# EAGLE schematic interfacez_r2_2 (EAGLE 6.4)
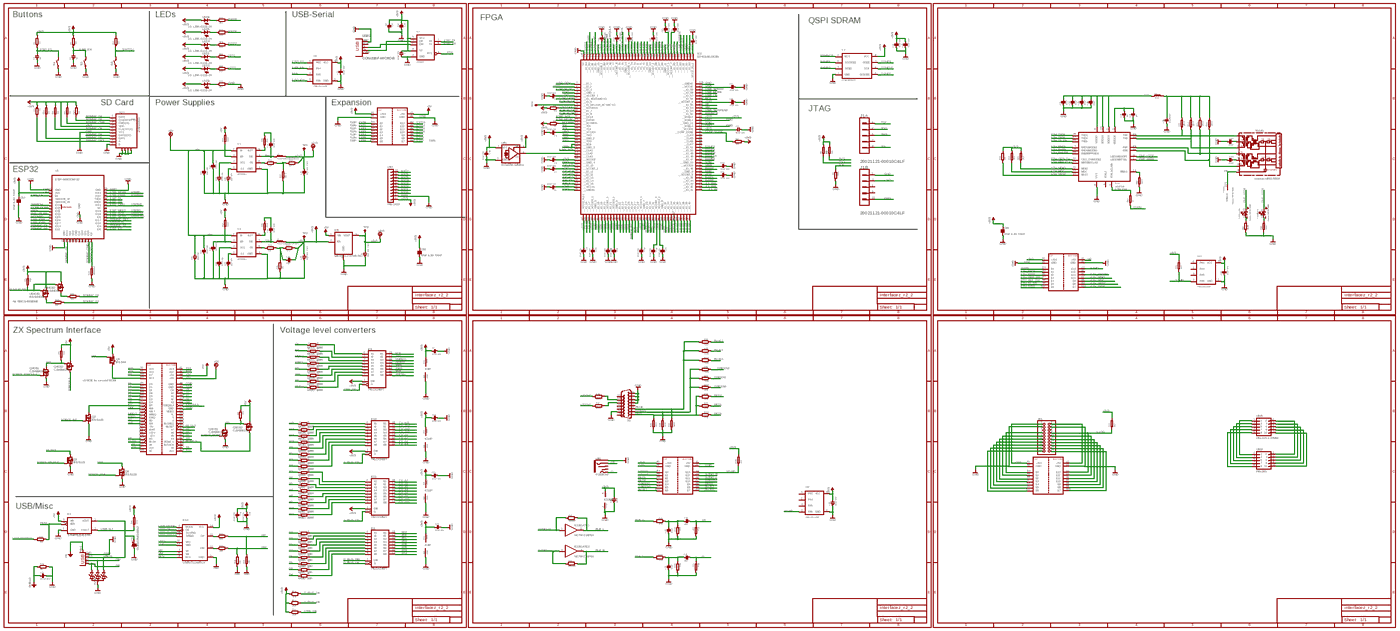
[diagram p0: schematic, sheet 1, overview]
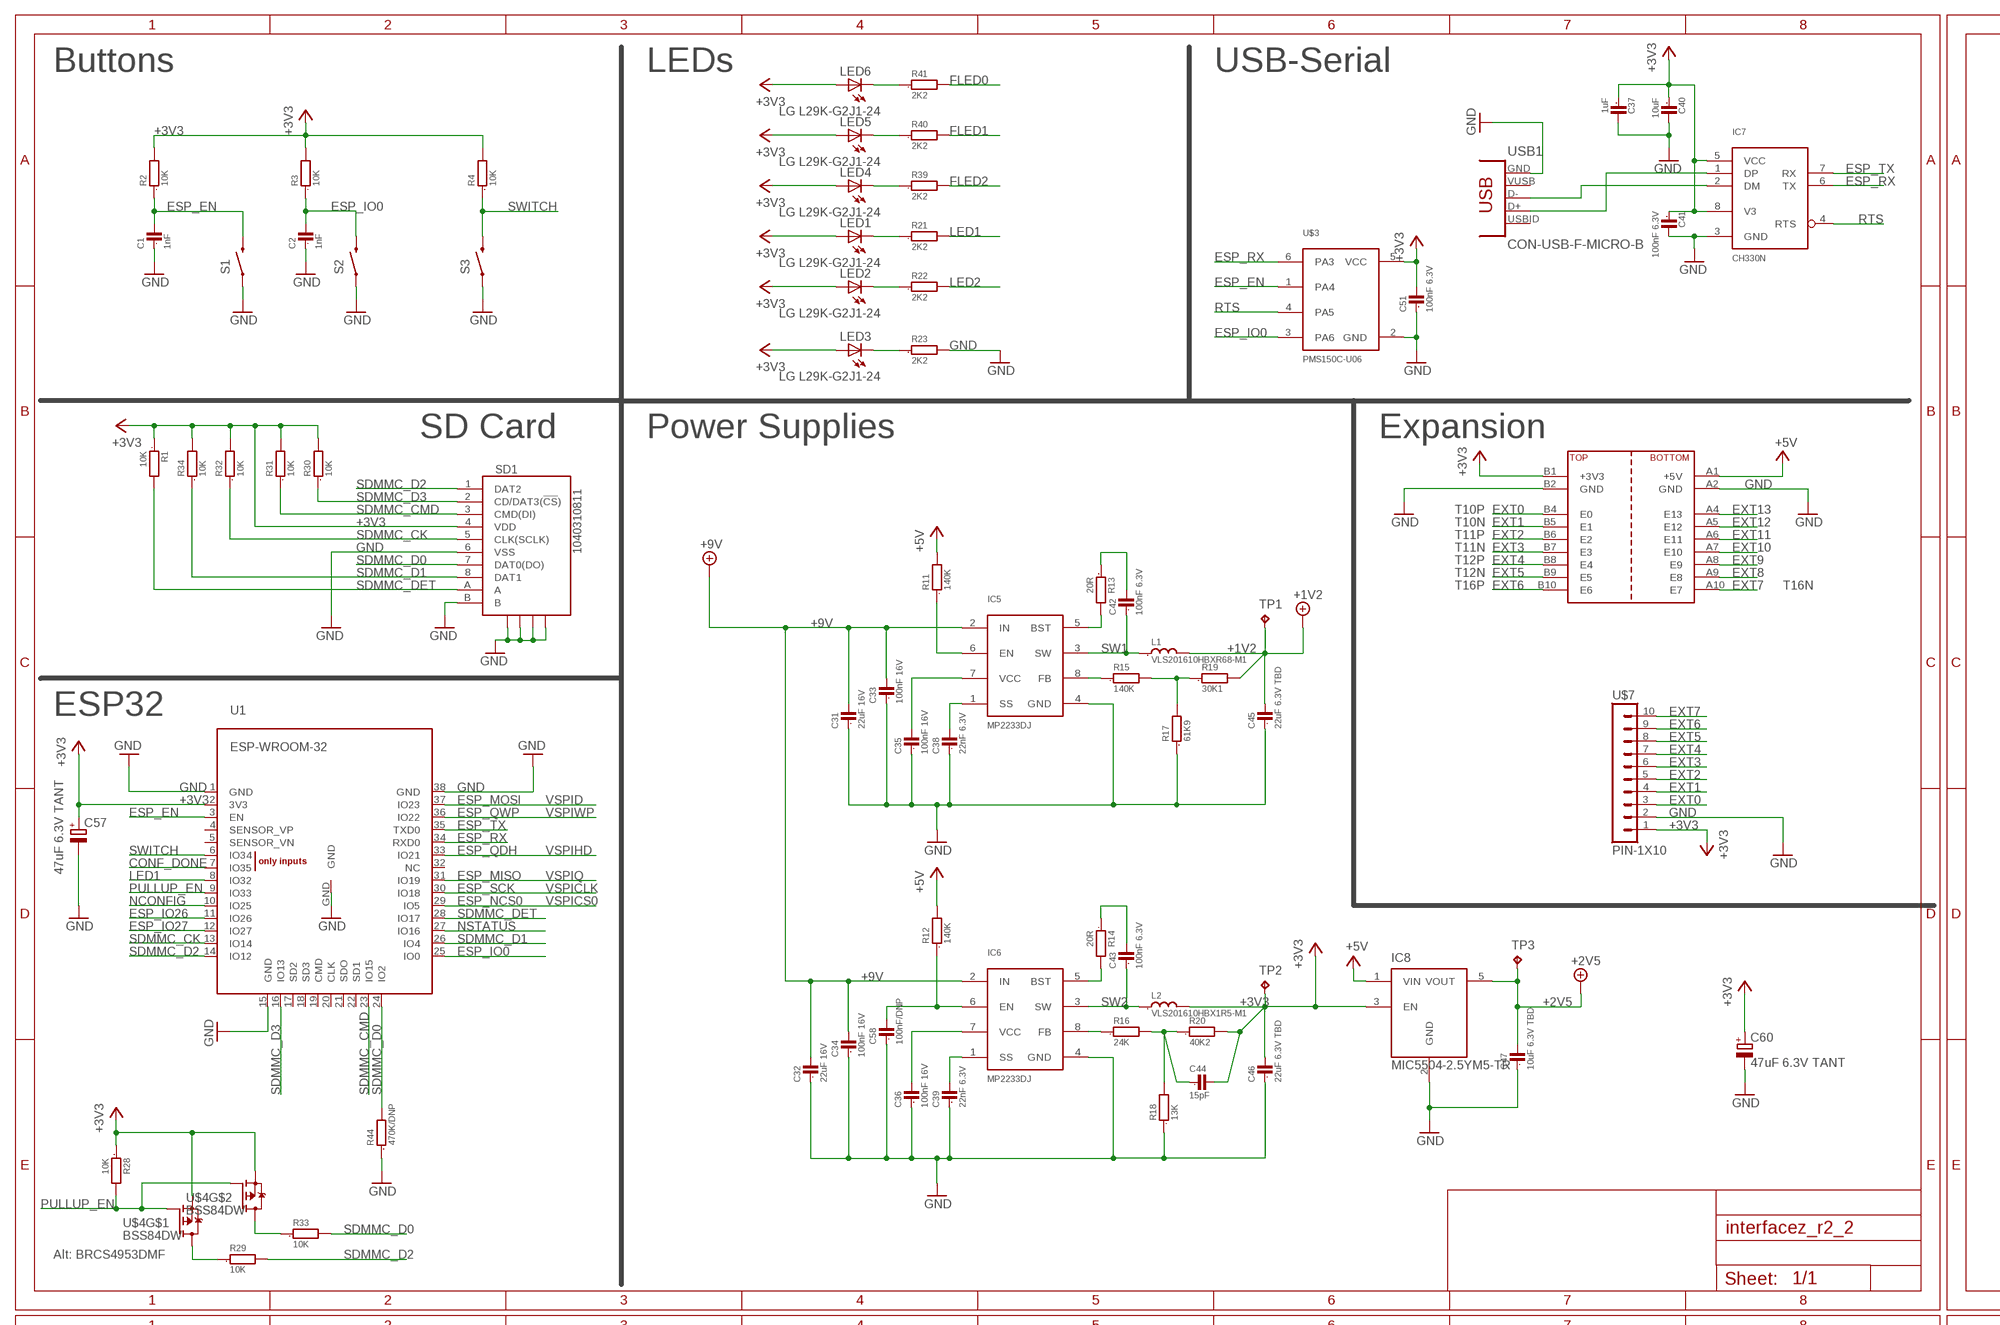
[diagram p1: schematic, sheet 1, part 1 of 8]
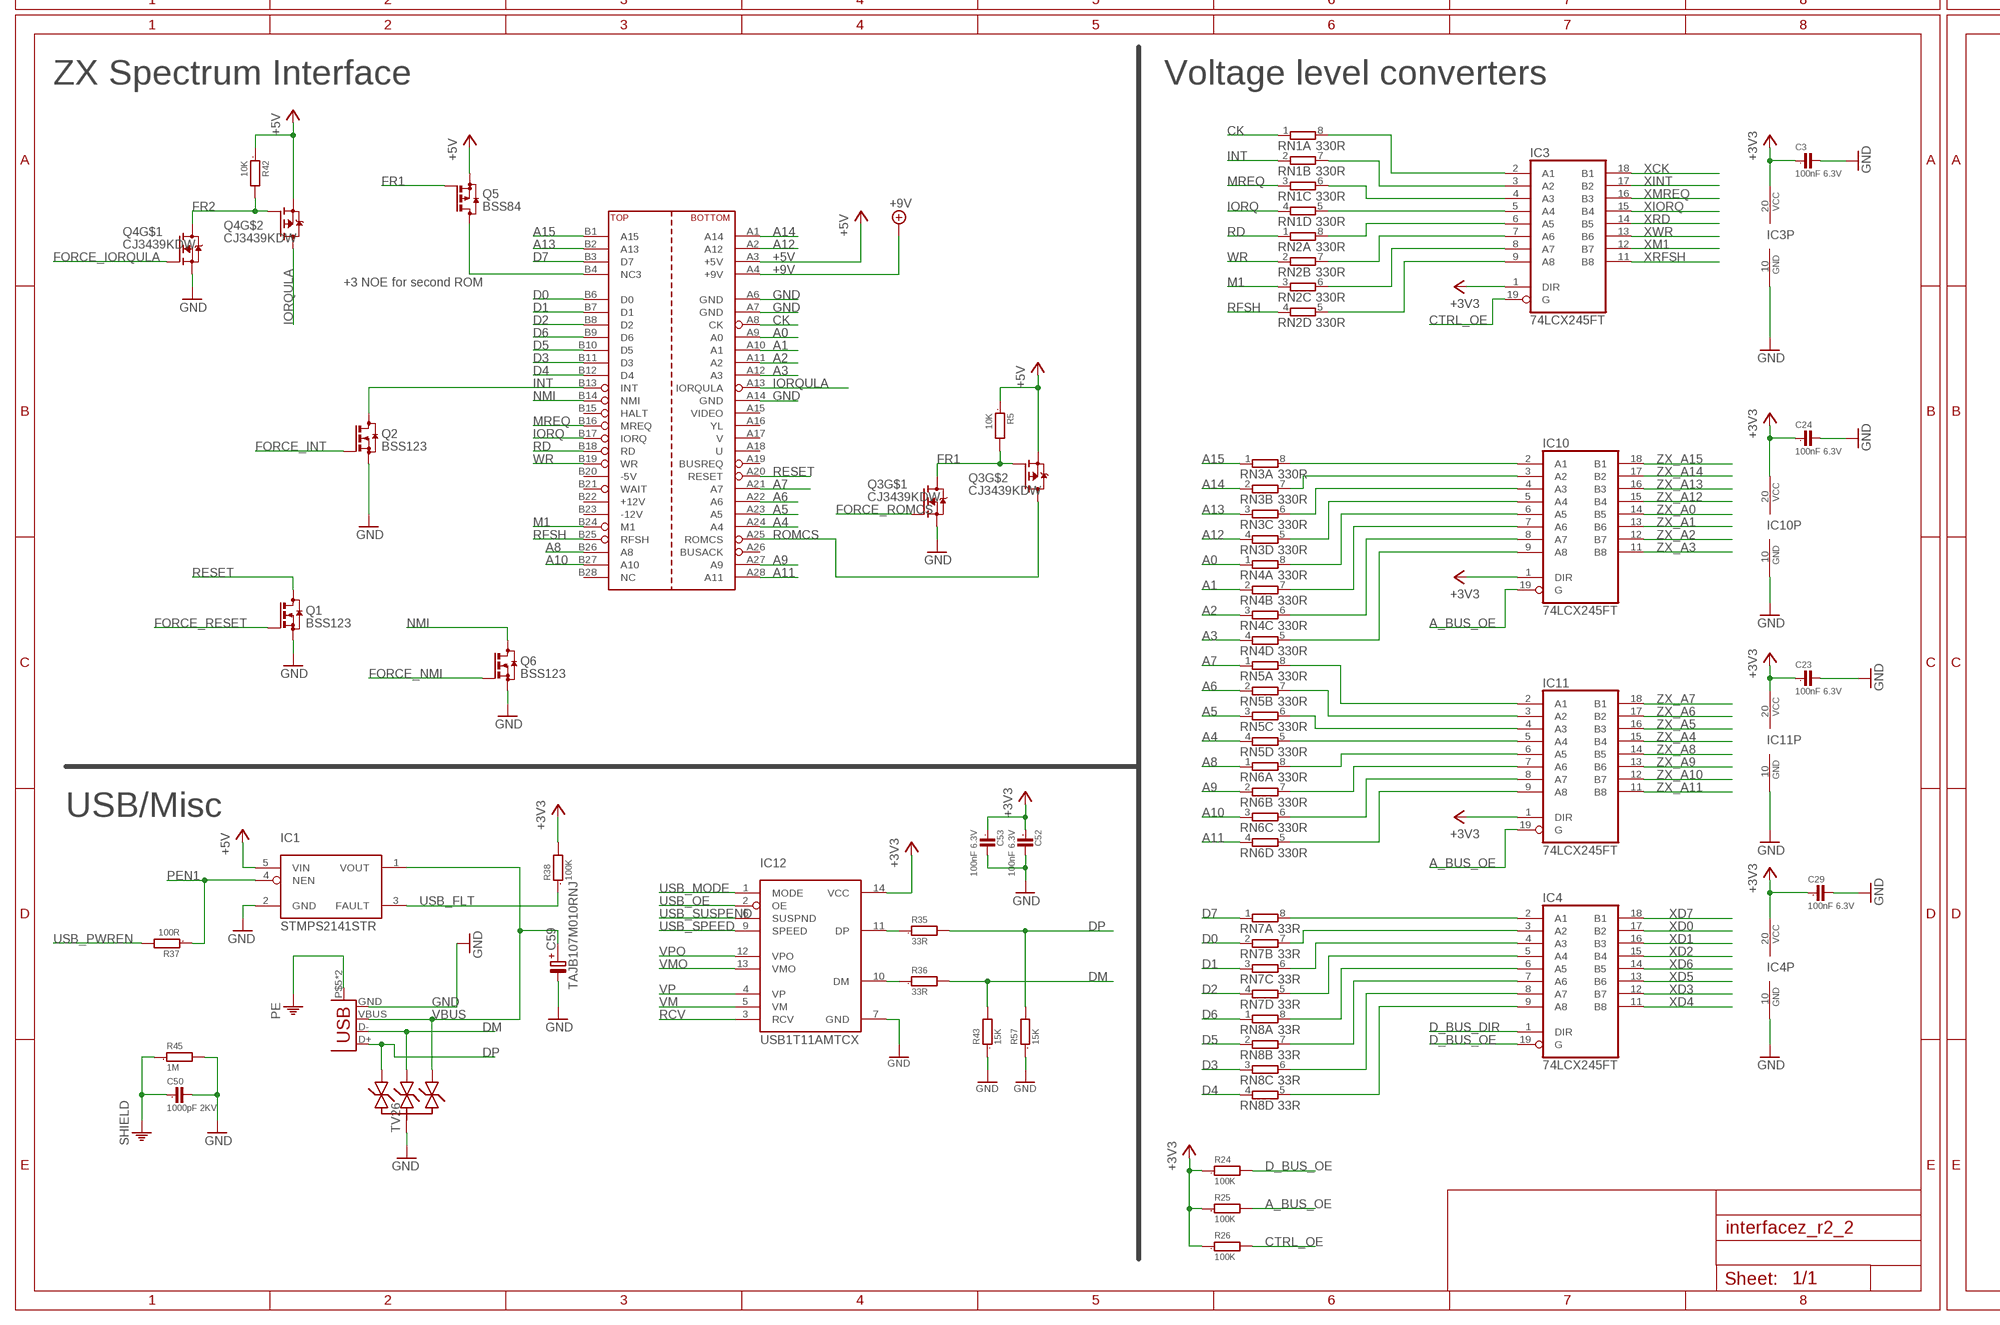
[diagram p2: schematic, sheet 1, part 2 of 8]
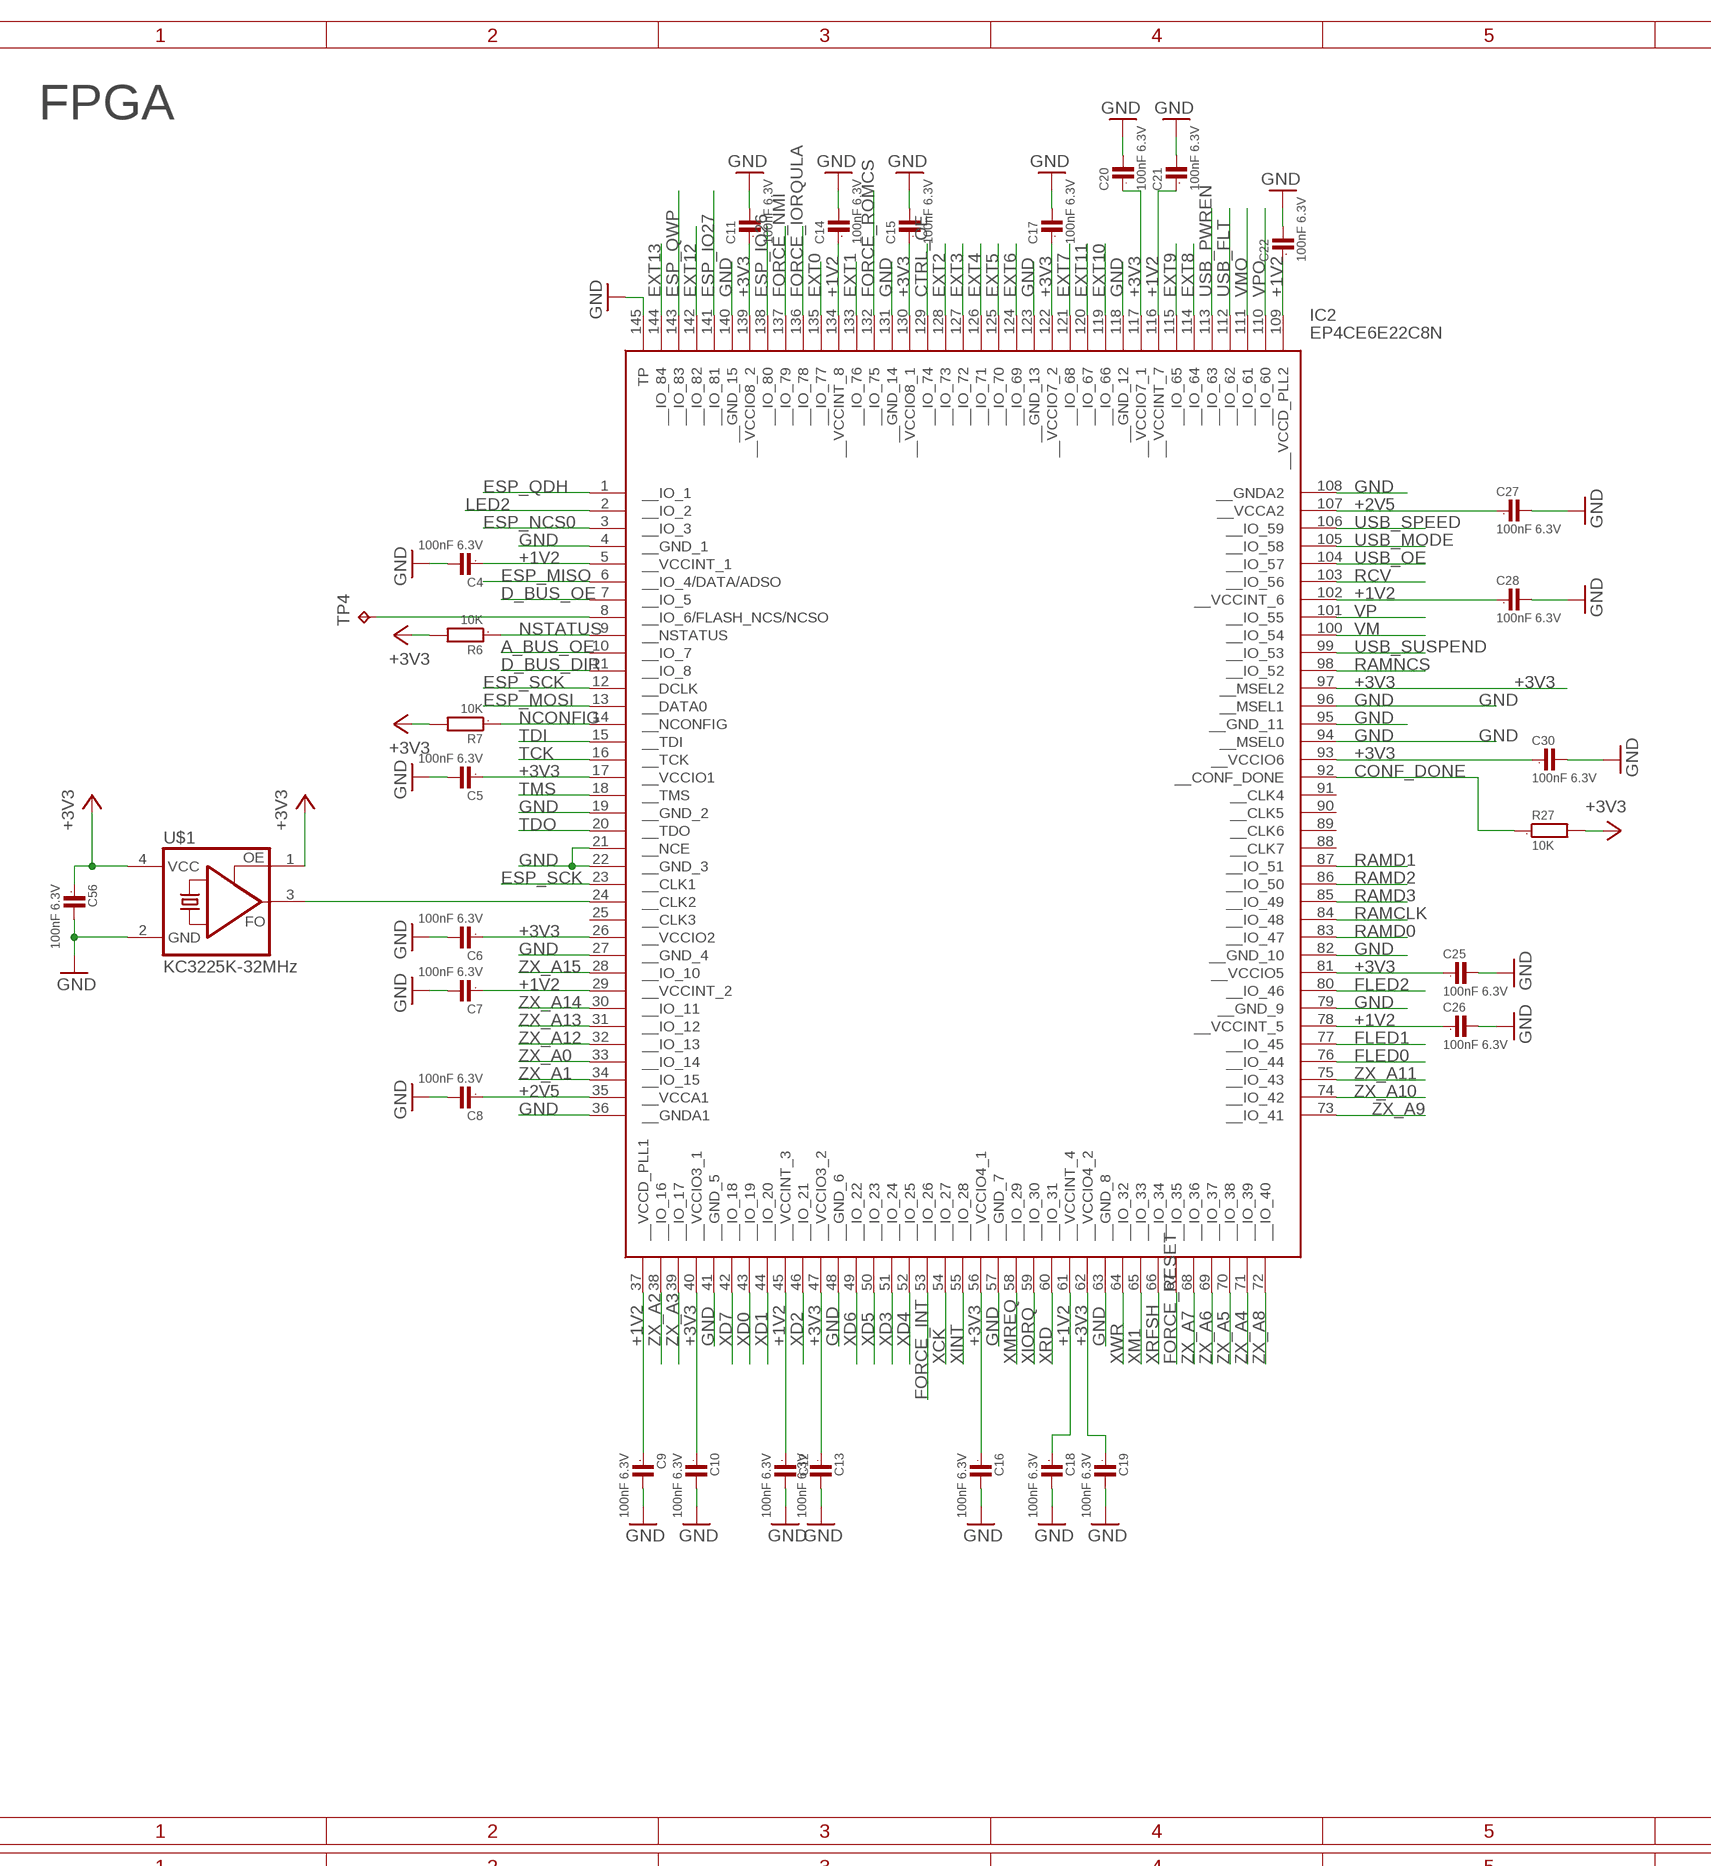
[diagram p3: schematic, sheet 1, part 3 of 8]
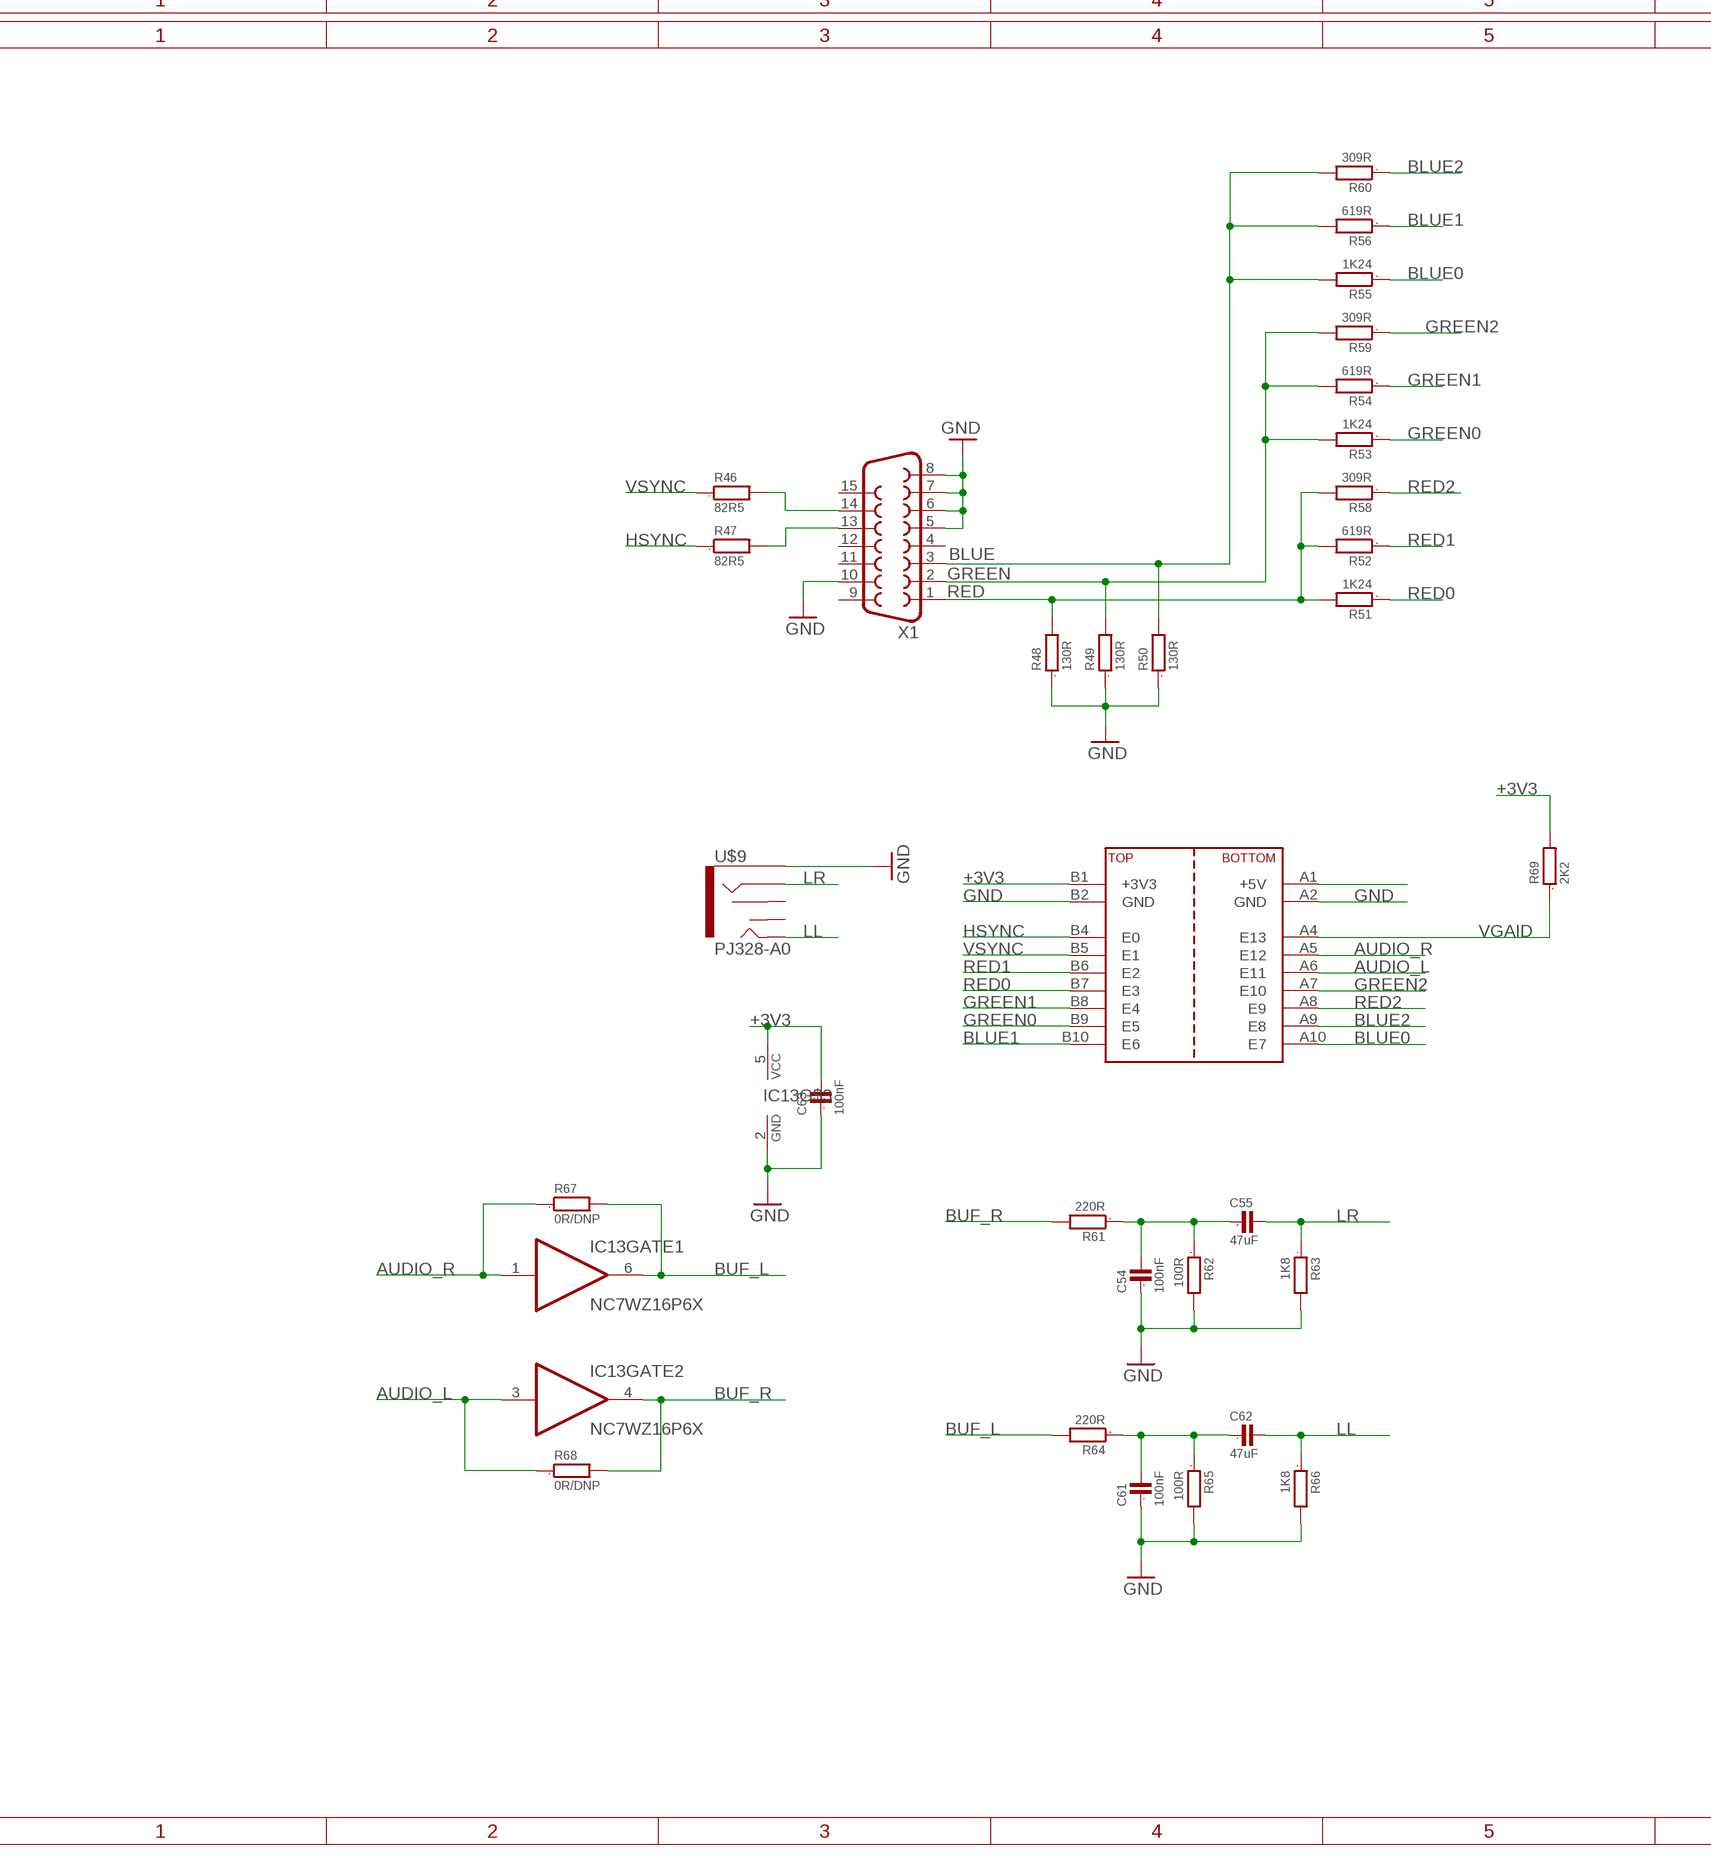
[diagram p4: schematic, sheet 1, part 4 of 8]
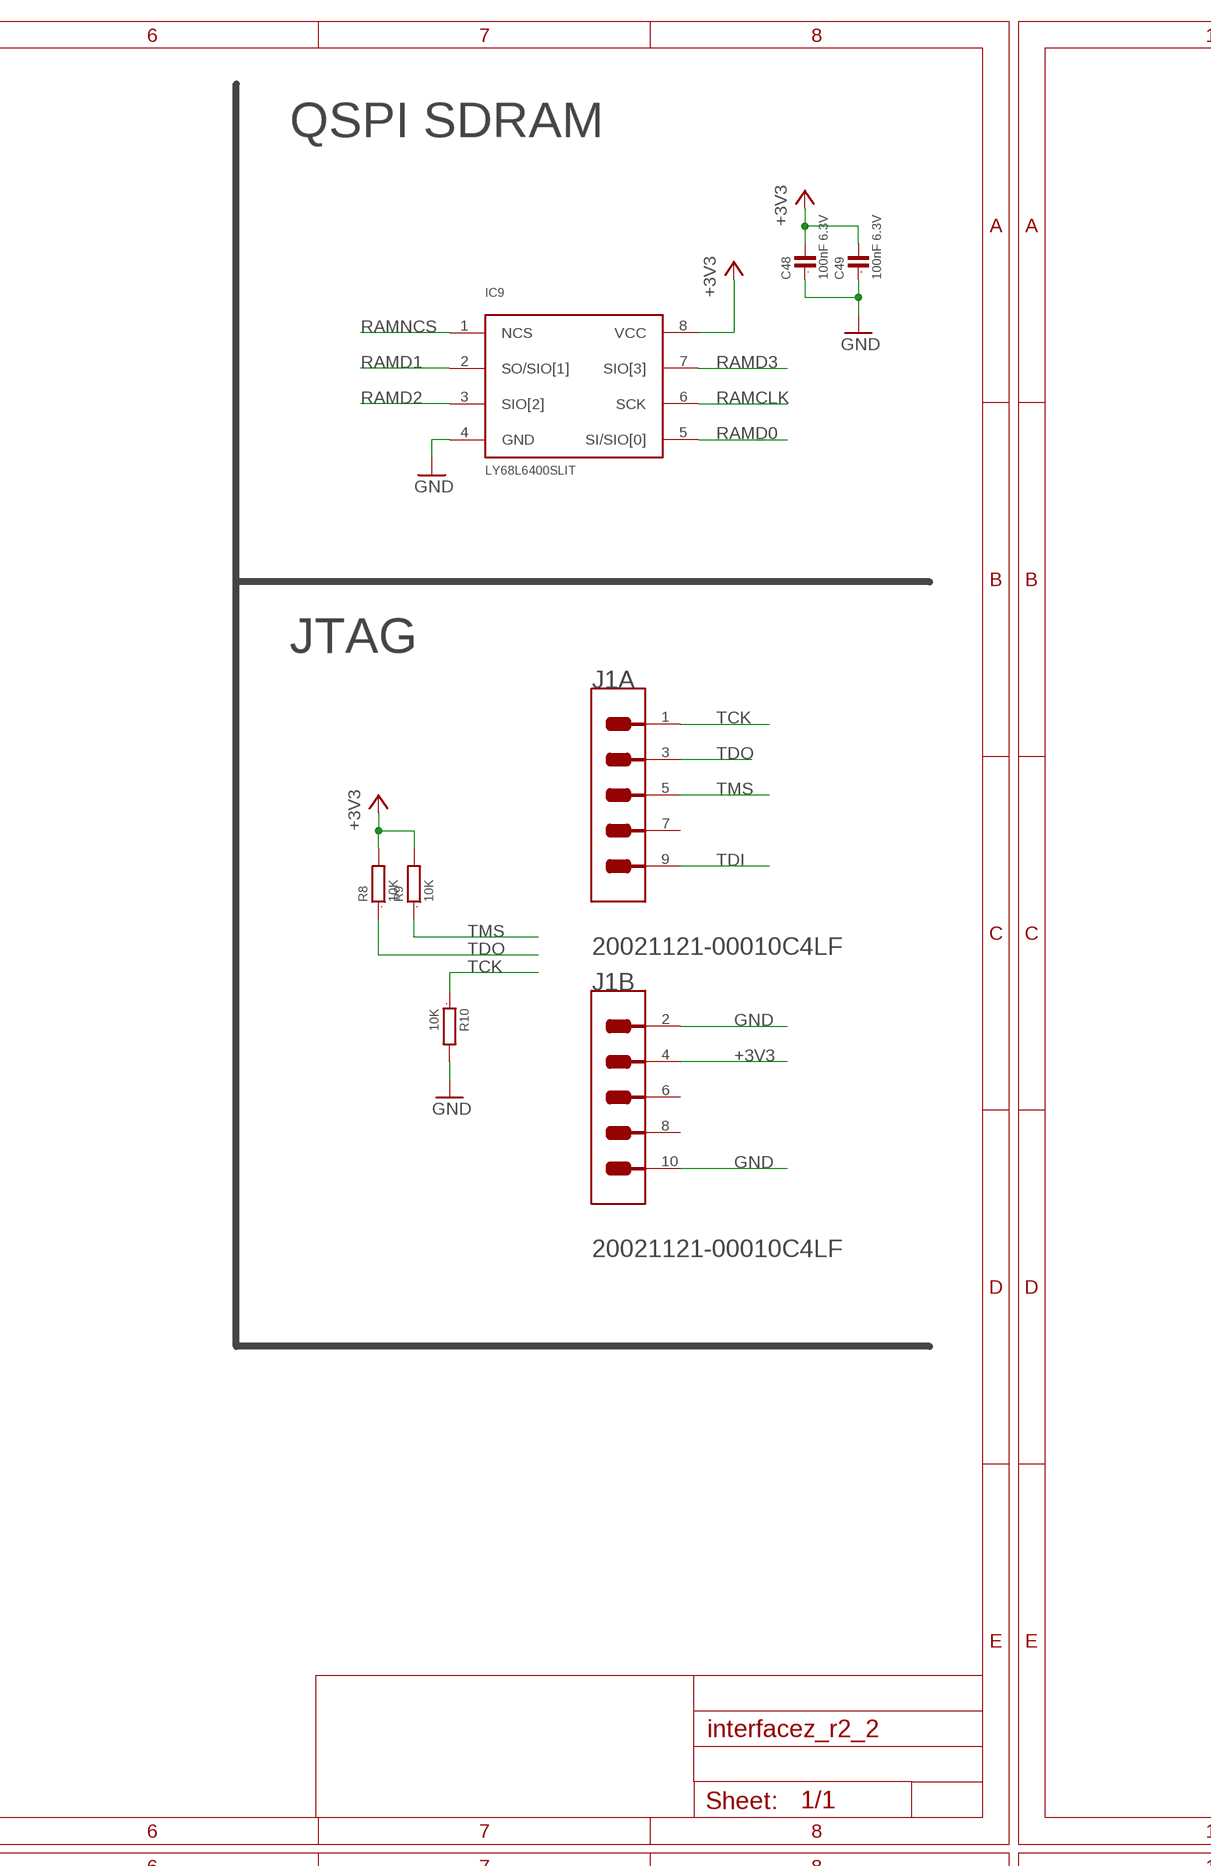
[diagram p5: schematic, sheet 1, part 5 of 8]
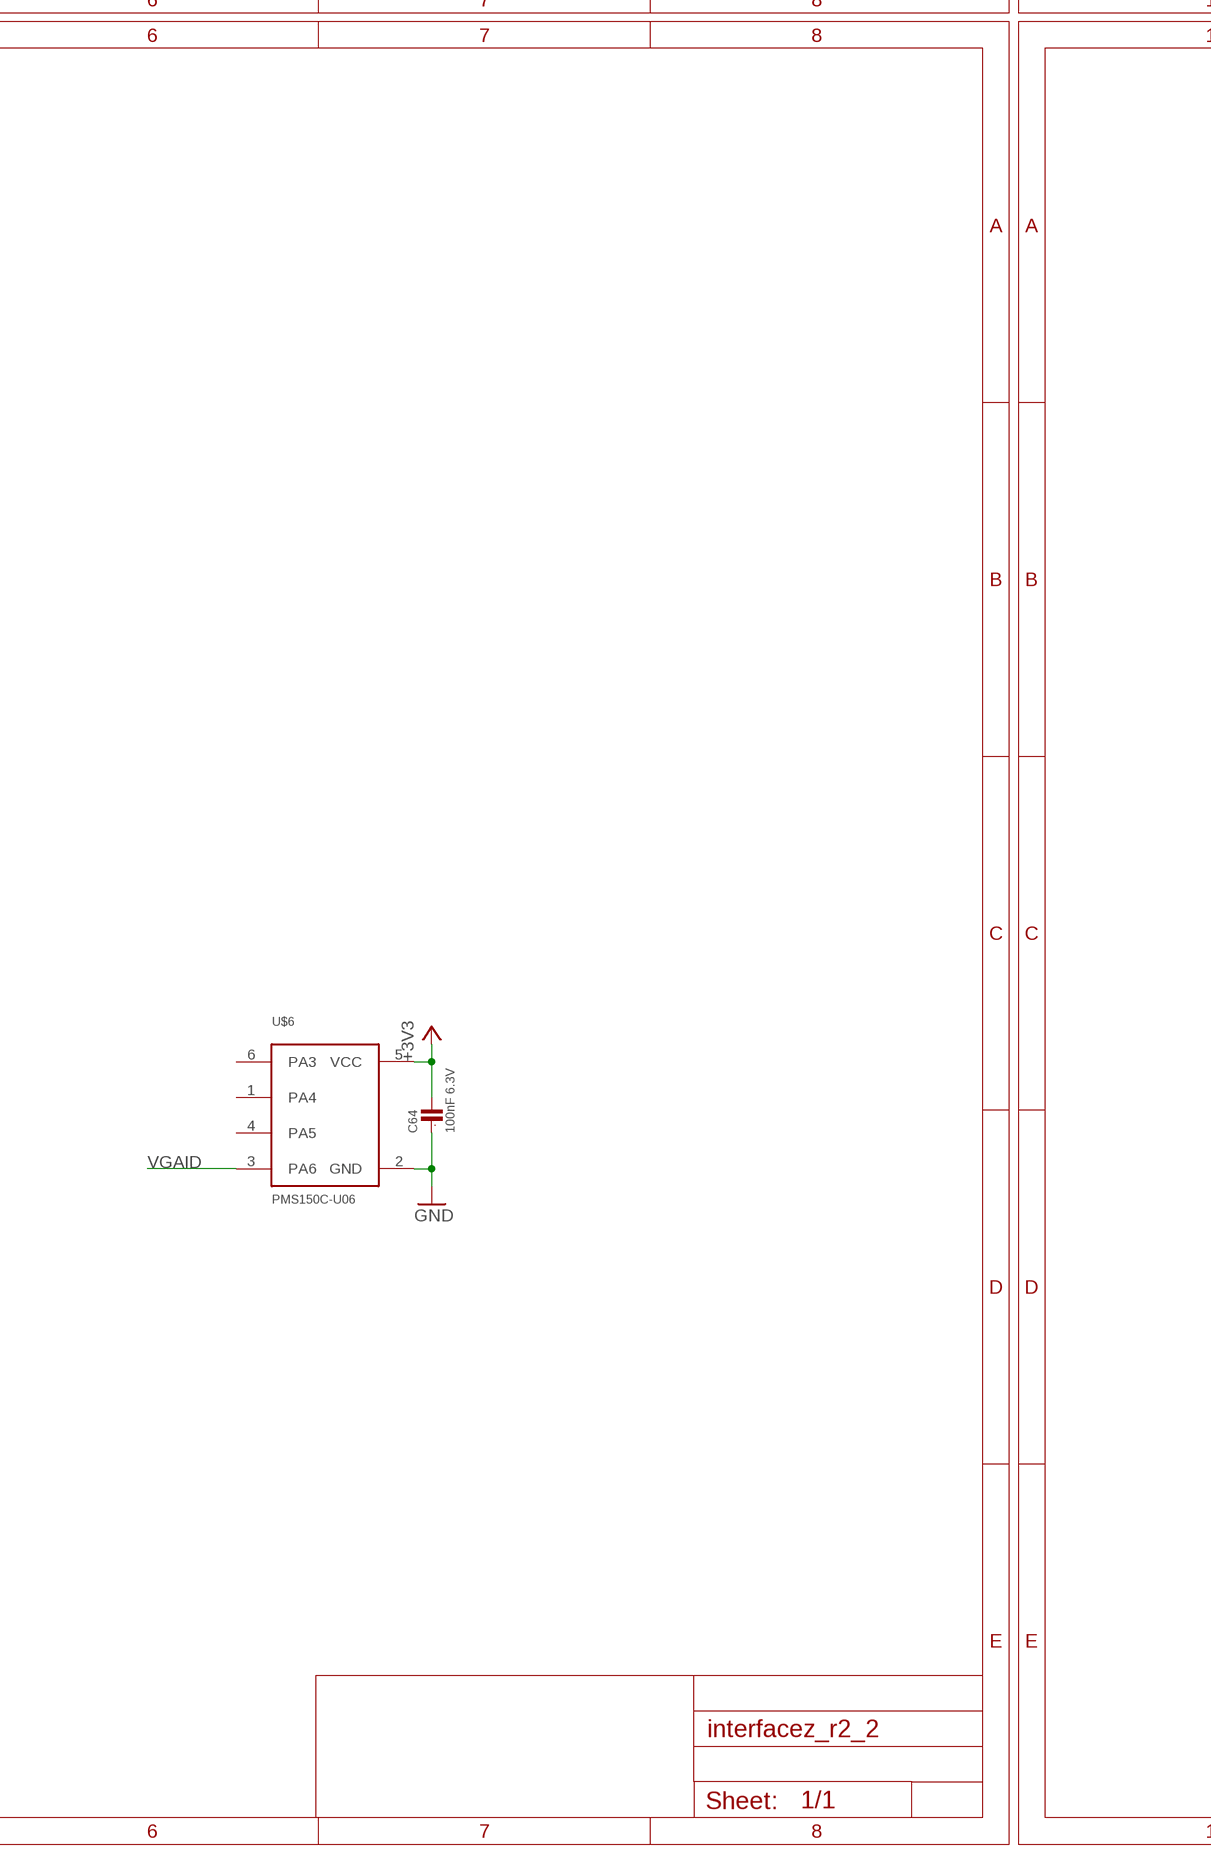
[diagram p6: schematic, sheet 1, part 6 of 8]
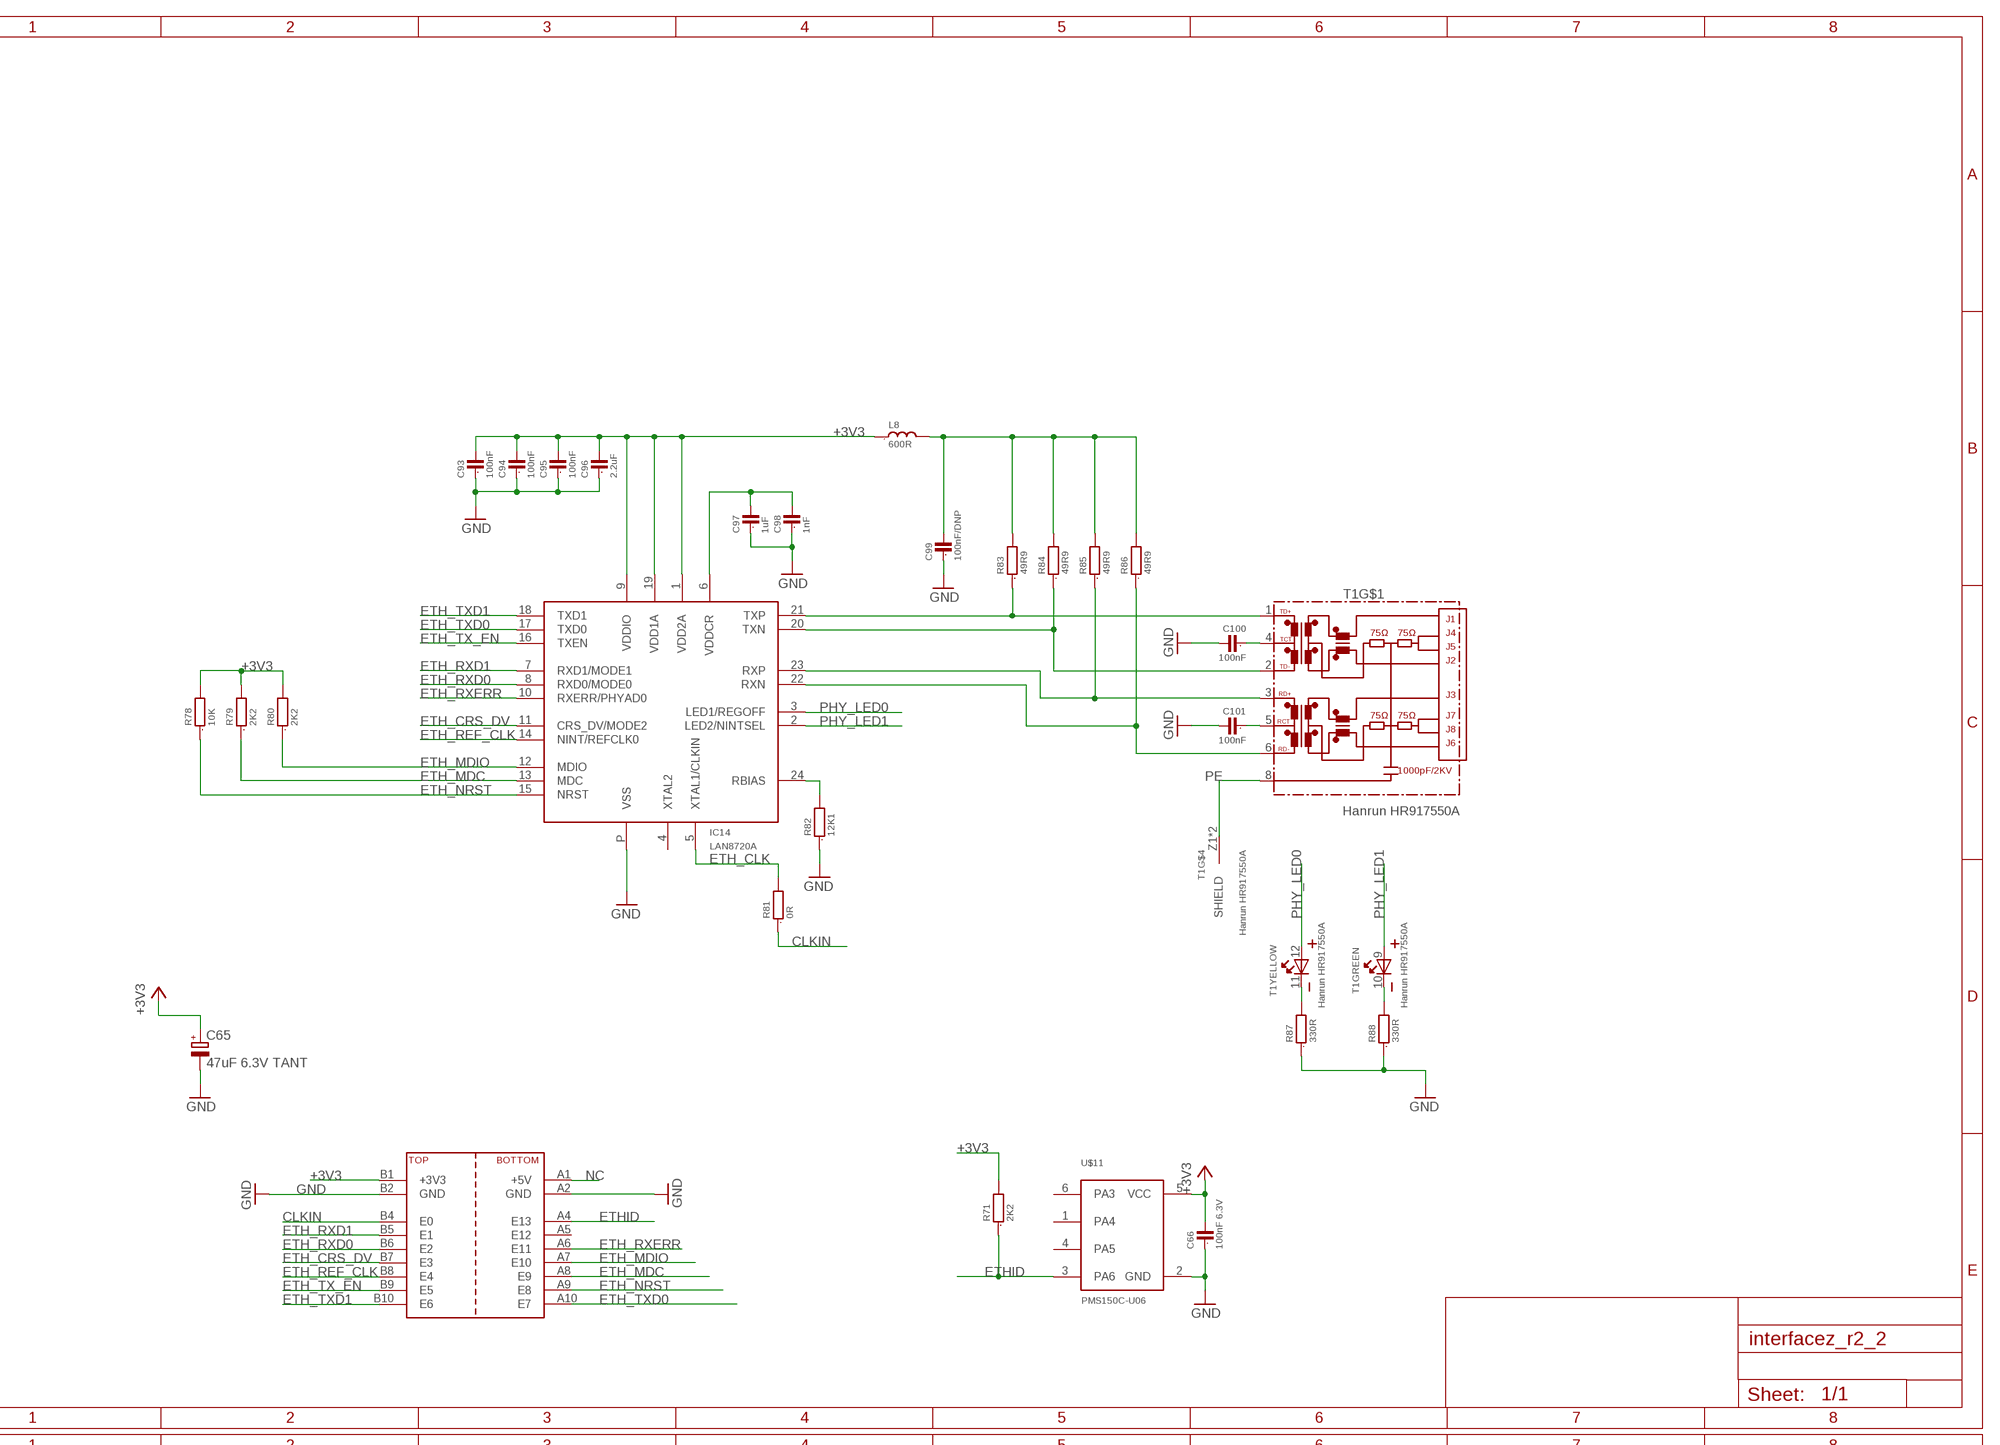
[diagram p7: schematic, sheet 1, part 7 of 8]
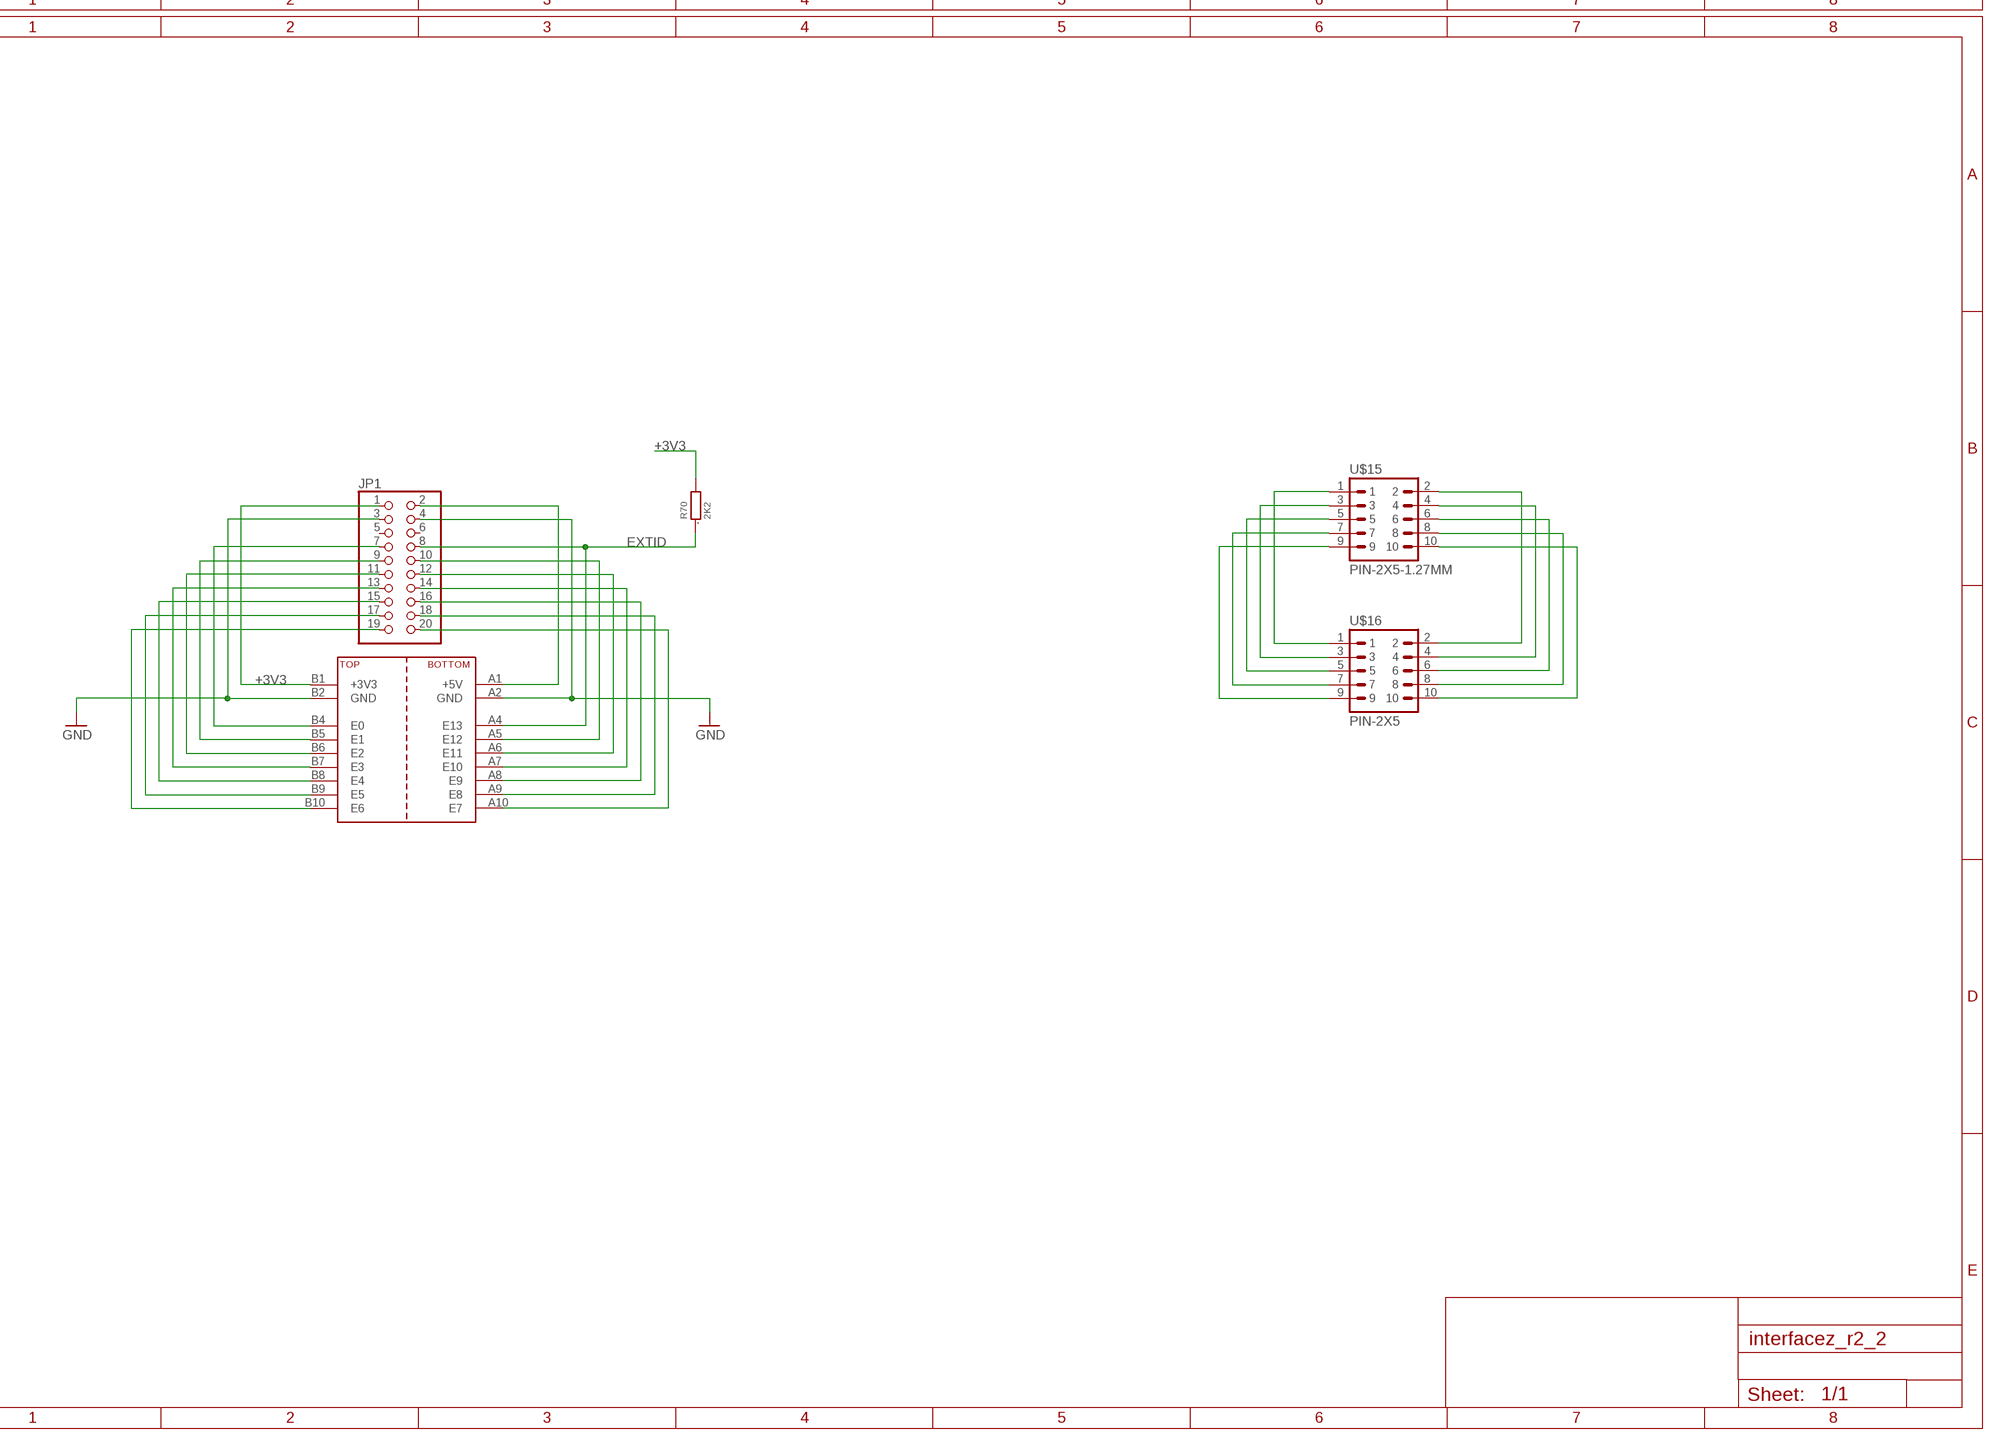
[diagram p8: schematic, sheet 1, part 8 of 8]

## Parts
C1  1nF  C0603  [0603]
C2  1nF  C0603  [0603]
C3  100nF 6.3V  C0603  [0603]
C4  100nF 6.3V  C0603  [0603]
C5  100nF 6.3V  C0603  [0603]
C6  100nF 6.3V  C0603  [0603]
C7  100nF 6.3V  C0603  [0603]
C8  100nF 6.3V  C0603  [0603]
C9  100nF 6.3V  C0603  [0603]
C10  100nF 6.3V  C0603  [0603]
C11  100nF 6.3V  C0603  [0603]
C12  100nF 6.3V  C0603  [0603]
C13  100nF 6.3V  C0603  [0603]
C14  100nF 6.3V  C0603  [0603]
C15  100nF 6.3V  C0603  [0603]
C16  100nF 6.3V  C0603  [0603]
C17  100nF 6.3V  C0603  [0603]
C18  100nF 6.3V  C0603  [0603]
C19  100nF 6.3V  C0603  [0603]
C20  100nF 6.3V  C0603  [0603]
C21  100nF 6.3V  C0603  [0603]
C22  100nF 6.3V  C0603  [0603]
C23  100nF 6.3V  C0603  [0603]
C24  100nF 6.3V  C0603  [0603]
C25  100nF 6.3V  C0603  [0603]
C26  100nF 6.3V  C0603  [0603]
C27  100nF 6.3V  C0603  [0603]
C28  100nF 6.3V  C0603  [0603]
C29  100nF 6.3V  C0603  [0603]
C30  100nF 6.3V  C0603  [0603]
C31  22uF 16V  C1210  [1210]
C32  22uF 16V  C1210  [1210]
C33  100nF 16V  C0603  [0603]
C34  100nF 16V  C0603  [0603]
C35  100nF 16V  C0603  [0603]
C36  100nF 16V  C0603  [0603]
C37  1uF  C0603  [0603]
C38  22nF 6.3V  C0603  [0603]
C39  22nF 6.3V  C0603  [0603]
C40  10uF  C0603  [0603]
C41  100nF 6.3V  C0603  [0603]
C42  100nF 6.3V  C0603  [0603]
C43  100nF 6.3V  C0603  [0603]
C44  15pF  C0603  [0603]
C45  22uF 6.3V TBD  C0805  [0805]
C46  22uF 6.3V TBD  C0805  [0805]
C47  10uF 6.3V TBD  C0805  [0805]
C48  100nF 6.3V  C0603  [0603]
C49  100nF 6.3V  C0603  [0603]
C50  1000pF 2KV  C1210  [1210]
C51  100nF 6.3V  C0603  [0603]
C52  100nF 6.3V  C0603  [0603]
C53  100nF 6.3V  C0603  [0603]
C54  100nF  C0603  [0603]
C55  47uF  C1206  [1206]
C56  100nF 6.3V  C0603  [0603]
C57  47uF 6.3V TANT  TANT_CASE_A  [TANT_CASE_A]
C58  100nF/DNP  C0603  [0603]
C59  TAJB107M010RNJ  C-PR-SMD-TE-B  [TE-B-3528]
C60  47uF 6.3V TANT  TANT_CASE_A  [TANT_CASE_A]
C61  100nF  C0603  [0603]
C62  47uF  C1206  [1206]
C63  100nF  C0603  [0603]
C64  100nF 6.3V  C0603  [0603]
C65  47uF 6.3V TANT  TANT_CASE_A  [TANT_CASE_A]
C66  100nF 6.3V  C0603  [0603]
C93  100nF  C0603  [0603]
C94  100nF  C0603  [0603]
C95  100nF  C0603  [0603]
C96  2.2uF  C0805  [0805]
C97  1uF  C0603  [0603]
C98  1nF  C0603  [0603]
C99  100nF/DNP  C0603  [0603]
C100  100nF  C0603  [0603]
C101  100nF  C0603  [0603]
CONN1  ZX_EDGE_DAUGHTERBOARD  [ZX-EDGE-DAUGHTERBOARD]
IC1  STMPS2141STR  [SOT23-5L]
IC2  EP4CE6E22C8N  [QFP50P2200X2200X165-145N]
IC3  74LCX245FT  74245  [TSSOP20]
IC4  74LCX245FT  74245  [TSSOP20]
IC5  MP2233DJ  [SOT23-8L]
IC6  MP2233DJ  [SOT23-8L]
IC7  CH330N  [SOIC8]
IC8  MIC5504-2.5YM5-TR  MIC550X  [SOT23-5L]
IC9  LY68L6400SLIT  [SOIC8]
IC10  74LCX245FT  74245  [TSSOP20]
IC11  74LCX245FT  74245  [TSSOP20]
IC12  USB1T11AMTCX  [TSSOP14]
IC13  NC7WZ16P6X  NC7WZ07P6X  [SC70-6]
IC14  LAN8720A  [QFN24_4MM_X_4MM]
J1  AMPHENOL_ICC_-_FCI_20021121-00010C4LFAMPHENOL_ICC_-_FCI_20021121-00010C4LF_0_0  [AMPHENOL_ICC_-_FCI_20021121-00010C4LF_0]
JP1  PINHD-2X10  [2X10]
L1  VLS201610HBXR68-M1  [IND_0806]
L2  VLS201610HBX1R5-M1  [IND_0806]
L8  600R  L0805  [0805]
LED1  LG L29K-G2J1-24  LED-0603  [LED-603]
LED2  LG L29K-G2J1-24  LED-0603  [LED-603]
LED3  LG L29K-G2J1-24  LED-0603  [LED-603]
LED4  LG L29K-G2J1-24  LED-0603  [LED-603]
LED5  LG L29K-G2J1-24  LED-0603  [LED-603]
LED6  LG L29K-G2J1-24  LED-0603  [LED-603]
Q1  BSS123  [SOT23]
Q2  BSS123  [SOT23]
Q3  CJ3439KDW  [SC70-6]
Q4  CJ3439KDW  [SC70-6]
Q5  BSS84  [SOT23]
Q6  BSS123  [SOT23]
R1  10K  R0603  [0603]
R2  10K  R0603  [0603]
R3  10K  R0603  [0603]
R4  10K  R0603  [0603]
R5  10K  R0603  [0603]
R6  10K  R0603  [0603]
R7  10K  R0603  [0603]
R8  10K  R0603  [0603]
R9  10K  R0603  [0603]
R10  10K  R0603  [0603]
R11  140K  R0603  [0603]
R12  140K  R0603  [0603]
R13  20R  R0603  [0603]
R14  20R  R0603  [0603]
R15  140K  R0603  [0603]
R16  24K  R0603  [0603]
R17  61K9  R0603  [0603]
R18  13K  R0603  [0603]
R19  30K1  R0603  [0603]
R20  40K2  R0603  [0603]
R21  2K2  R0603  [0603]
R22  2K2  R0603  [0603]
R23  2K2  R0603  [0603]
R24  100K  R0603  [0603]
R25  100K  R0603  [0603]
R26  100K  R0603  [0603]
R27  10K  R0603  [0603]
R28  10K  R0603  [0603]
R29  10K  R0603  [0603]
R30  10K  R0603  [0603]
R31  10K  R0603  [0603]
R32  10K  R0603  [0603]
R33  10K  R0603  [0603]
R34  10K  R0603  [0603]
R35  33R  R0603  [0603]
R36  33R  R0603  [0603]
R37  100R  R0603  [0603]
R38  100K  R0603  [0603]
R39  2K2  R0603  [0603]
R40  2K2  R0603  [0603]
R41  2K2  R0603  [0603]
R42  10K  R0603  [0603]
R43  15K  R0603  [0603]
R44  470K/DNP  R0603  [0603]
R45  1M  R0805  [0805]
R46  82R5  R0603  [0603]
R47  82R5  R0603  [0603]
R48  130R  R0603  [0603]
R49  130R  R0603  [0603]
R50  130R  R0603  [0603]
R51  1K24  R0603  [0603]
R52  619R  R0603  [0603]
R53  1K24  R0603  [0603]
R54  619R  R0603  [0603]
R55  1K24  R0603  [0603]
R56  619R  R0603  [0603]
R57  15K  R0603  [0603]
R58  309R  R0603  [0603]
R59  309R  R0603  [0603]
R60  309R  R0603  [0603]
R61  220R  R0603  [0603]
R62  100R  R0603  [0603]
R63  1K8  R0603  [0603]
R64  220R  R0603  [0603]
R65  100R  R0603  [0603]
R66  1K8  R0603  [0603]
R67  0R/DNP  R0603  [0603]
R68  0R/DNP  R0603  [0603]
R69  2K2  R0603  [0603]
R70  2K2  R0603  [0603]
R71  2K2  R0603  [0603]
R78  10K  R0603  [0603]
R79  2K2  R0603  [0603]
R80  2K2  R0603  [0603]
R81  0R  R0603  [0603]
R82  12K1  R0603  [0603]
R83  49R9  R0603  [0603]
R84  49R9  R0603  [0603]
R85  49R9  R0603  [0603]
R86  49R9  R0603  [0603]
R87  330R  R0603  [0603]
R88  330R  R0603  [0603]
RN1  330R  4R-NEXB28V  [EXB28V]
RN2  330R  4R-NEXB28V  [EXB28V]
RN3  330R  4R-NEXB28V  [EXB28V]
RN4  330R  4R-NEXB28V  [EXB28V]
RN5  330R  4R-NEXB28V  [EXB28V]
RN6  330R  4R-NEXB28V  [EXB28V]
RN7  33R  4R-NEXB28V  [EXB28V]
RN8  33R  4R-NEXB28V  [EXB28V]
S1  SWITCHES_SMD-4  [TACTILE_SWITCH_TALL]
S2  SWITCHES_SMD-4  [TACTILE_SWITCH_TALL]
S3  SWITCHES_SMD-4  [TACTILE_SWITCH_TALL]
SD1  1040310811  [1040310811]
T1  Hanrun HR917550A  HR913550A  [HR13550A]
TP1  TPTP12R  [TP12R]
TP2  TPTP12R  [TP12R]
TP3  TPTP12R  [TP12R]
TP4  TPTP08R  [TP08R]
TV26  SP0503BAHT  [SP0503]
U1  ESP-WROOM-32  [ESP-WROOM-32]
U$1  KC3225K-32MHz  KC3225K  [KC3225K]
U$2  INTERFACEZ_EDGEDAUGHTER  [INTERFACEZ_EXPANSION_DAUGHTERCARD]
U$3  PMS150C-U06  [SOT23-6]
U$4  BSS84DW  [SOT363_INFINEON]
U$5  INTERFACEZ_EDGEDAUGHTER  [INTERFACEZ_EXPANSION_DAUGHTERCARD]
U$6  PMS150C-U06  [SOT23-6]
U$7  PIN-1X10  [PIN-1X10]
U$8  INTERFACEZ_EDGEDAUGHTER  [INTERFACEZ_EXPANSION_DAUGHTERCARD]
U$9  PJ328-A0  [PJ328A0]
U$10  INTERFACEZ_EDGEDAUGHTER  [INTERFACEZ_EXPANSION_DAUGHTERCARD]
U$11  PMS150C-U06  [SOT23-6]
U$15  PIN-2X5-1.27MM  [PIN-2X5-1.27]
U$16  PIN-2X5  [PIN-2X5]
USB1  CON-USB-F-MICRO-B  [CONN_USB_MICRO-B]
USB2  USB-A-H  [USB-A-H]
X1  F15HDH  [HDF15H]

## Nets
+1V2: C4.1 C7.1 C9.1 C12.1 C14.1 C18.1 C21.1 C22.1 C26.1 C28.1 C45.2 IC2.5(__VCCINT_1) IC2.29(__VCCINT_2) IC2.37(__VCCD_PLL1) IC2.45(__VCCINT_3) IC2.61(__VCCINT_4) IC2.78(__VCCINT_5) IC2.102(__VCCINT_6) IC2.109(__VCCD_PLL2) IC2.116(__VCCINT_7) IC2.134(__VCCINT_8) L1.P$2 R19.2 TP1.TP
+2V5: C8.1 C27.1 C47.2 IC2.35(__VCCA1) IC2.107(__VCCA2) IC8.5(VOUT) TP3.TP
+3V3: C3.1 C5.1 C6.1 C10.1 C11.1 C13.1 C15.1 C16.1 C17.1 C19.1 C20.1 C23.1 C24.1 C25.1 C29.1 C30.1 C37.1 C40.1 C41.1 C44.2 C46.2 C48.2 C49.2 C51.2 C52.1 C53.1 C56.1 C57.PLUS(+) C60.PLUS(+) C63.2 C64.2 C65.PLUS(+) C66.2 C93.2 C94.2 C95.2 C96.2 IC2.17(__VCCIO1) IC2.26(__VCCIO2) IC2.40(__VCCIO3_1) IC2.47(__VCCIO3_2) IC2.56(__VCCIO4_1) IC2.62(__VCCIO4_2) IC2.81(__VCCIO5) IC2.93(__VCCIO6) IC2.97(__MSEL2) IC2.117(__VCCIO7_1) IC2.122(__VCCIO7_2) IC2.130(__VCCIO8_1) IC2.139(__VCCIO8_2) IC3.1(DIR) IC3.20(VCC) IC4.20(VCC) IC7.5(VCC) IC7.8(V3) IC8.3(EN) IC9.8(VCC) IC10.1(DIR) IC10.20(VCC) IC11.1(DIR) IC11.20(VCC) IC12.14(VCC) IC13.5(VCC) IC14.1(VDD2A) IC14.9(VDDIO) IC14.19(VDD1A) J1.4 JP1.1 L2.P$2 L8.1 LED1.A LED2.A LED3.A LED4.A LED5.A LED6.A R1.1 R2.2 R3.2 R4.2 R6.2 R7.2 R8.2 R9.2 R20.2 R24.1 R25.1 R26.1 R27.2 R28.1 R30.2 R31.2 R32.2 R34.2 R38.2 R69.2 R70.2 R71.2 R78.2 R79.2 R80.2 SD1.4(VDD) TP2.TP U1.2(3V3) U$1.1(OE) U$1.4(VCC) U$2.B1(+3V3) U$3.5(VCC) U$4.1(S) U$4.4(S) U$5.B1(+3V3) U$6.5(VCC) U$7.1 U$8.B1(+3V3) U$10.B1(+3V3) U$11.5(VCC)
+5V: CONN1.A3(+5V) IC1.5(VIN) IC8.1(VIN) Q3.4(S) Q4.4(S) Q5.2(S) R5.1 R11.2 R12.2 R42.1 U$5.A1(+5V)
+9V: C31.2 C32.2 C33.2 C34.2 CONN1.A4(+9V) IC5.2(IN) IC6.2(IN)
A0: CONN1.A9(A0) RN4.1
A1: CONN1.A10(A1) RN4.2
A2: CONN1.A11(A2) RN4.3
A3: CONN1.A12(A3) RN4.4
A4: CONN1.A24(A4) RN5.4
A5: CONN1.A23(A5) RN5.3
A6: CONN1.A22(A6) RN5.2
A7: CONN1.A21(A7) RN5.1
A8: CONN1.B26(A8) RN6.1
A9: CONN1.A27(A9) RN6.2
A10: CONN1.B27(A10) RN6.3
A11: CONN1.A28(A11) RN6.4
A12: CONN1.A2(A12) RN3.4
A13: CONN1.B2(A13) RN3.3
A14: CONN1.A1(A14) RN3.2
A15: CONN1.B1(A15) RN3.1
A_BUS_OE: IC2.10(__IO_7) IC10.19(G) IC11.19(G) R25.2
AUDIO_L: IC13.3(GATE2:I) R68.1 U$8.A6(E11)
AUDIO_R: IC13.1(GATE1:I) R67.1 U$8.A5(E12)
BLUE: R50.2 R55.2 R56.2 R60.2 X1.3
BLUE0: R55.1 U$8.A10(E7)
BLUE1: R56.1 U$8.B10(E6)
BLUE2: R60.1 U$8.A9(E8)
BUF_L: IC13.6(GATE1:O) R64.2 R67.2
BUF_R: IC13.4(GATE2:O) R61.2 R68.2
CK: CONN1.A8(CK) RN1.1
CLKIN: R81.1 U$10.B4(E0)
CONF_DONE: IC2.92(__CONF_DONE) R27.1 U1.7(IO35)
CTRL_OE: IC2.129(__IO_74) IC3.19(G) R26.2
D0: CONN1.B6(D0) RN7.2
D1: CONN1.B7(D1) RN7.3
D2: CONN1.B8(D2) RN7.4
D3: CONN1.B11(D3) RN8.3
D4: CONN1.B12(D4) RN8.4
D5: CONN1.B10(D5) RN8.2
D6: CONN1.B9(D6) RN8.1
D7: CONN1.B3(D7) RN7.1
D_BUS_DIR: IC2.11(__IO_8) IC4.1(DIR)
D_BUS_OE: IC2.7(__IO_5) IC4.19(G) R24.2
DM: R36.2 R43.2 TV26.3(B) USB2.D-
DP: R35.2 R57.2 TV26.2(A) USB2.D+
ESP_EN: C1.2 R2.1 S1.B2 U1.3(EN) U$3.1(PA4)
ESP_IO0: C2.2 R3.1 S2.B2 U1.25(IO0) U$3.3(PA6)
ESP_IO26: IC2.138(__IO_80) U1.11(IO26)
ESP_IO27: IC2.141(__IO_81) U1.12(IO27)
ESP_MISO: IC2.6(__IO_4/DATA/ADSO) U1.31(IO19)
ESP_MOSI: IC2.13(__DATA0) U1.37(IO23)
ESP_NCS0: IC2.3(__IO_3) U1.29(IO5)
ESP_QDH: IC2.1(__IO_1) U1.33(IO21)
ESP_QWP: IC2.143(__IO_83) U1.36(IO22)
ESP_RX: IC7.6(TX) U1.34(RXD0) U$3.6(PA3)
ESP_SCK: IC2.12(__DCLK) IC2.23(__CLK1) U1.30(IO18)
ESP_TX: IC7.7(RX) U1.35(TXD0)
ETH_CLK: IC14.5(XTAL1/CLKIN) R81.2
ETH_CRS_DV: IC14.11(CRS_DV/MODE2) U$10.B7(E3)
ETH_MDC: IC14.13(MDC) R79.1 U$10.A8(E9)
ETH_MDIO: IC14.12(MDIO) R80.1 U$10.A7(E10)
ETH_NRST: IC14.15(NRST) R78.1 U$10.A9(E8)
ETH_REF_CLK: IC14.14(NINT/REFCLK0) U$10.B8(E4)
ETH_RXD0: IC14.8(RXD0/MODE0) U$10.B6(E2)
ETH_RXD1: IC14.7(RXD1/MODE1) U$10.B5(E1)
ETH_RXERR: IC14.10(RXERR/PHYAD0) U$10.A6(E11)
ETH_TX_EN: IC14.16(TXEN) U$10.B9(E5)
ETH_TXD0: IC14.17(TXD0) U$10.A10(E7)
ETH_TXD1: IC14.18(TXD1) U$10.B10(E6)
ETHID: R71.1 U$10.A4(E13) U$11.3(PA6)
EXT0: IC2.135(__IO_77) U$5.B4(E0) U$7.3
EXT1: IC2.133(__IO_76) U$5.B5(E1) U$7.4
EXT2: IC2.128(__IO_73) U$5.B6(E2) U$7.5
EXT3: IC2.127(__IO_72) U$5.B7(E3) U$7.6
EXT4: IC2.126(__IO_71) U$5.B8(E4) U$7.7
EXT5: IC2.125(__IO_70) U$5.B9(E5) U$7.8
EXT6: IC2.124(__IO_69) U$5.B10(E6) U$7.9
EXT7: IC2.121(__IO_68) U$5.A10(E7) U$7.10
EXT8: IC2.114(__IO_64) U$5.A9(E8)
EXT9: IC2.115(__IO_65) U$5.A8(E9)
EXT10: IC2.119(__IO_66) U$5.A7(E10)
EXT11: IC2.120(__IO_67) U$5.A6(E11)
EXT12: IC2.142(__IO_82) U$5.A5(E12)
EXT13: IC2.144(__IO_84) U$5.A4(E13)
EXTID: JP1.8 R70.1 U$2.A4(E13)
FLED0: IC2.76(__IO_44) R41.2
FLED1: IC2.77(__IO_45) R40.2
FLED2: IC2.80(__IO_46) R39.2
FORCE_INT: IC2.53(__IO_26) Q2.1(G)
FORCE_IORQULA: IC2.136(__IO_78) Q4.2(G)
FORCE_NMI: IC2.137(__IO_79) Q6.1(G)
FORCE_RESET: IC2.67(__IO_35) Q1.1(G)
FORCE_ROMCS: IC2.132(__IO_75) Q3.2(G)
FR1: Q3.5(G) Q3.6(D) Q5.1(G) R5.2
FR2: Q4.5(G) Q4.6(D) R42.2
GND: C1.1 C2.1 C3.2 C4.2 C5.2 C6.2 C7.2 C8.2 C9.2 C10.2 C11.2 C12.2 C13.2 C14.2 C15.2 C16.2 C17.2 C18.2 C19.2 C20.2 C21.2 C22.2 C23.2 C24.2 C25.2 C26.2 C27.2 C28.2 C29.2 C30.2 C31.1 C32.1 C33.1 C34.1 C35.1 C36.1 C37.2 C38.1 C39.1 C40.2 C41.2 C45.1 C46.1 C47.1 C48.1 C49.1 C50.2 C51.1 C52.2 C53.2 C54.1 C56.2 C57.MINUS(-) C58.1 C59.- C60.MINUS(-) C61.1 C63.1 C64.1 C65.MINUS(-) C66.1 C93.1 C94.1 C95.1 C96.1 C97.1 C98.1 C99.1 C100.2 C101.2 CONN1.A6(GND) CONN1.A7(GND) CONN1.A14(GND) IC1.2(GND) IC2.4(__GND_1) IC2.19(__GND_2) IC2.21(__NCE) IC2.22(__GND_3) IC2.27(__GND_4) IC2.36(__GNDA1) IC2.41(__GND_5) IC2.48(__GND_6) IC2.57(__GND_7) IC2.63(__GND_8) IC2.79(__GND_9) IC2.82(__GND_10) IC2.94(__MSEL0) IC2.95(__GND_11) IC2.96(__MSEL1) IC2.108(__GNDA2) IC2.118(__GND_12) IC2.123(__GND_13) IC2.131(__GND_14) IC2.140(__GND_15) IC2.145(TP) IC3.10(GND) IC4.10(GND) IC5.4(GND) IC6.4(GND) IC7.3(GND) IC8.2(GND) IC9.4(GND) IC10.10(GND) IC11.10(GND) IC12.7(GND) IC13.2(GND) IC14.P(VSS) J1.2 J1.10 JP1.3 JP1.4 Q1.2(S) Q2.2(S) Q3.1(S) Q4.1(S) Q6.2(S) R10.2 R17.1 R18.1 R23.2 R43.1 R44.1 R45.2 R48.1 R49.1 R50.1 R57.1 R62.2 R63.2 R65.2 R66.2 R82.1 R87.1 R88.1 S1.A2 S2.A2 S3.A2 SD1.6(VSS) SD1.B SD1.MNT1(S1) SD1.MNT2(S2) SD1.MNT3(S3) SD1.MNT4(S4) TV26.1(COM) U1.1(GND) U1.15(GND) U1.38(GND) U1.GND U$1.2(GND) U$2.A2(GND) U$2.B2(GND) U$3.2(GND) U$5.A2(GND) U$5.B2(GND) U$6.2(GND) U$7.2 U$8.A2(GND) U$8.B2(GND) U$9.1(SLEEVE) U$10.A2(GND) U$10.B2(GND) U$11.2(GND) USB1.P5(GND) USB2.GND X1.5 X1.6 X1.7 X1.8 X1.10
GREEN: R49.2 R53.2 R54.2 R59.2 X1.2
GREEN0: R53.1 U$8.B9(E5)
GREEN1: R54.1 U$8.B8(E4)
GREEN2: R59.1 U$8.A7(E10)
HSYNC: R47.1 U$8.B4(E0)
INT: CONN1.B13(INT) Q2.3(D) RN1.2
IORQ: CONN1.B17(IORQ) RN1.4
IORQULA: CONN1.A13(IORQULA) Q4.3(D)
LED1: R21.2 U1.8(IO32)
LED2: IC2.2(__IO_2) R22.2
LL: C62.2 R66.1 U$9.2(TIP)
LR: C55.2 R63.1 U$9.3(RING)
M1: CONN1.B24(M1) RN2.3
MREQ: CONN1.B16(MREQ) RN1.3
N$1: IC2.8(__IO_6/FLASH_NCS/NCSO) TP4.TP
N$2: LED1.C R21.1
N$3: LED2.C R22.1
N$4: LED3.C R23.1
N$5: R47.2 X1.13
N$6: R46.2 X1.14
N$7: IC3.2(A1) RN1.8
N$8: IC3.3(A2) RN1.7
N$9: IC10.2(A1) RN3.8
N$10: IC10.3(A2) RN3.7
N$11: IC10.4(A3) RN3.6
N$12: IC10.5(A4) RN3.5
N$13: IC2.24(__CLK2) U$1.3(FO)
N$14: IC10.6(A5) RN4.8
N$15: IC10.7(A6) RN4.7
N$16: IC4.2(A1) RN7.8
N$17: IC4.3(A2) RN7.7
N$18: IC10.8(A7) RN4.6
N$19: IC6.5(BST) R14.2
N$20: LED4.C R39.1
N$21: C43.2 R14.1
N$22: IC10.9(A8) RN4.5
N$23: IC11.2(A1) RN5.8
N$24: IC11.3(A2) RN5.7
N$25: IC11.4(A3) RN5.6
N$26: IC11.5(A4) RN5.5
N$27: IC11.6(A5) RN6.8
N$28: IC11.7(A6) RN6.7
N$29: IC11.8(A7) RN6.6
N$30: IC11.9(A8) RN6.5
N$31: IC4.4(A3) RN7.6
N$32: IC4.5(A4) RN7.5
N$33: IC4.6(A5) RN8.8
N$34: IC4.7(A6) RN8.7
N$35: IC4.8(A7) RN8.6
N$36: IC4.9(A8) RN8.5
N$37: IC3.4(A3) RN1.6
N$38: IC3.5(A4) RN1.5
N$39: IC3.6(A5) RN2.8
N$40: IC3.7(A6) RN2.7
N$41: IC3.8(A7) RN2.6
N$42: IC3.9(A8) RN2.5
N$43: C39.2 IC6.1(SS)
N$44: IC5.5(BST) R13.2
N$45: C36.2 IC6.7(VCC)
N$46: C42.2 R13.1
N$47: C38.2 IC5.1(SS)
N$48: C35.2 IC5.7(VCC)
N$49: IC6.8(FB) R16.1
N$50: C44.1 R16.2 R18.2 R20.1
N$51: IC5.8(FB) R15.1
N$52: C58.2 IC6.6(EN) R12.1
N$53: R15.2 R17.2 R19.1
N$54: IC5.6(EN) R11.1
N$55: U$8.A1(+5V)
N$56: R29.1 U$4.3(D)
N$57: LED5.C R40.1
N$58: LED6.C R41.1
N$59: IC12.11(DP) R35.1
N$60: IC12.10(DM) R36.1
N$61: JP1.2 U$2.A1(+5V)
N$62: R33.1 U$4.6(D)
N$63: CONN1.B4(NC3) Q5.3(D)
N$64: C101.1 T1.5
N$65: C100.1 T1.4
N$66: JP1.7 U$2.B4(E0)
N$67: C61.2 C62.1 R64.1 R65.1
N$68: C54.2 C55.1 R61.1 R62.1
N$69: JP1.9 U$2.B5(E1)
N$70: JP1.11 U$2.B6(E2)
N$71: JP1.13 U$2.B7(E3)
N$72: JP1.15 U$2.B8(E4)
N$73: JP1.17 U$2.B9(E5)
N$74: JP1.19 U$2.B10(E6)
N$75: C99.2 L8.2 R83.2 R84.2 R85.2 R86.2
N$76: R87.2 T1.11(YELLOW:K)
N$77: JP1.10 U$2.A5(E12)
N$78: JP1.12 U$2.A6(E11)
N$79: JP1.14 U$2.A7(E10)
N$80: JP1.16 U$2.A8(E9)
N$81: JP1.18 U$2.A9(E8)
N$82: JP1.20 U$2.A10(E7)
N$83: R88.2 T1.10(GREEN:K)
N$84: IC14.24(RBIAS) R82.2
N$85: C97.2 C98.2 IC14.6(VDDCR)
N$86: U$15.1 U$16.1
N$87: U$15.3 U$16.3
N$88: U$15.5 U$16.5
N$89: U$15.7 U$16.7
N$90: U$15.9 U$16.9
N$91: U$15.2 U$16.2
N$92: U$15.4 U$16.4
N$93: U$15.6 U$16.6
N$94: U$15.8 U$16.8
N$95: U$15.10 U$16.10
N$149: IC7.1(DP) USB1.P3(D+)
N$150: IC7.2(DM) USB1.P2(D-)
NC: U$10.A1(+5V)
NCONFIG: IC2.14(__NCONFIG) R7.1 U1.10(IO25)
NMI: CONN1.B14(NMI) Q6.3(D)
NSTATUS: IC2.9(__NSTATUS) R6.1 U1.27(IO16)
PE: C50.1 R45.1 T1.8 T1.Z1(SHIELD) T1.Z2(SHIELD) USB2.P$5(SHIELD) USB2.P$6(SHIELD) ; supply symbol labelled SHIELD
PEN1: IC1.4(NEN) R37.1
PHY_LED0: IC14.3(LED1/REGOFF) T1.12(YELLOW:A)
PHY_LED1: IC14.2(LED2/NINTSEL) T1.9(GREEN:A)
PULLUP_EN: R28.2 U1.9(IO33) U$4.2(G) U$4.5(G)
RAMCLK: IC2.84(__IO_48) IC9.6(SCK)
RAMD0: IC2.83(__IO_47) IC9.5(SI/SIO[0])
RAMD1: IC2.87(__IO_51) IC9.2(SO/SIO[1])
RAMD2: IC2.86(__IO_50) IC9.3(SIO[2])
RAMD3: IC2.85(__IO_49) IC9.7(SIO[3])
RAMNCS: IC2.98(__IO_52) IC9.1(NCS)
RCV: IC2.103(__IO_56) IC12.3(RCV)
RD: CONN1.B18(RD) RN2.1
RED: R48.2 R51.2 R52.2 R58.2 X1.1
RED0: R51.1 U$8.B7(E3)
RED1: R52.1 U$8.B6(E2)
RED2: R58.1 U$8.A8(E9)
RESET: CONN1.A20(RESET) Q1.3(D)
RFSH: CONN1.B25(RFSH) RN2.4
ROMCS: CONN1.A25(ROMCS) Q3.3(D)
RTS: IC7.4(RTS) U$3.4(PA5)
RXM: IC14.20(TXN) R84.1 T1.2
RXP: IC14.21(TXP) R83.1 T1.1
SDMMC_CK: R32.1 SD1.5(CLK(SCLK)) U1.13(IO14)
SDMMC_CMD: R31.1 SD1.3(CMD(DI)) U1.23(IO15)
SDMMC_D0: R33.2 R44.2 SD1.7(DAT0(DO)) U1.24(IO2)
SDMMC_D1: R34.1 SD1.8(DAT1) U1.26(IO4)
SDMMC_D2: R29.2 SD1.1(DAT2) U1.14(IO12)
SDMMC_D3: R30.1 SD1.2(CD/DAT3(!CS!)) U1.16(IO13)
SDMMC_DET: R1.2 SD1.A U1.28(IO17)
SW1: C42.1 IC5.3(SW) L1.P$1
SW2: C43.1 IC6.3(SW) L2.P$1
SWITCH: R4.1 S3.B2 U1.6(IO34)
TCK: IC2.16(__TCK) J1.1 R10.1
TDI: IC2.15(__TDI) J1.9
TDO: IC2.20(__TDO) J1.3 R8.1
TMS: IC2.18(__TMS) J1.5 R9.1
TXM: IC14.22(RXN) R86.1 T1.6
TXP: IC14.23(RXP) R85.1 T1.3
USB_FLT: IC1.3(FAULT) IC2.112(__IO_62) R38.1
USB_MODE: IC2.105(__IO_58) IC12.1(MODE)
USB_OE: IC2.104(__IO_57) IC12.2(OE)
USB_PWREN: IC2.113(__IO_63) R37.2
USB_SPEED: IC2.106(__IO_59) IC12.9(SPEED)
USB_SUSPEND: IC2.99(__IO_53) IC12.6(SUSPND)
VBUS: C59.+ IC1.1(VOUT) TV26.4(C) USB2.VBUS
VGAID: R69.1 U$6.3(PA6) U$8.A4(E13)
VM: IC2.100(__IO_54) IC12.5(VM)
VMO: IC2.111(__IO_61) IC12.13(VMO)
VP: IC2.101(__IO_55) IC12.4(VP)
VPO: IC2.110(__IO_60) IC12.12(VPO)
VSYNC: R46.1 U$8.B5(E1)
WR: CONN1.B19(WR) RN2.2
XCK: IC2.54(__IO_27) IC3.18(B1)
XD0: IC2.43(__IO_19) IC4.17(B2)
XD1: IC2.44(__IO_20) IC4.16(B3)
XD2: IC2.46(__IO_21) IC4.15(B4)
XD3: IC2.51(__IO_24) IC4.12(B7)
XD4: IC2.52(__IO_25) IC4.11(B8)
XD5: IC2.50(__IO_23) IC4.13(B6)
XD6: IC2.49(__IO_22) IC4.14(B5)
XD7: IC2.42(__IO_18) IC4.18(B1)
XINT: IC2.55(__IO_28) IC3.17(B2)
XIORQ: IC2.59(__IO_30) IC3.15(B4)
XM1: IC2.65(__IO_33) IC3.12(B7)
XMREQ: IC2.58(__IO_29) IC3.16(B3)
XRD: IC2.60(__IO_31) IC3.14(B5)
XRFSH: IC2.66(__IO_34) IC3.11(B8)
XWR: IC2.64(__IO_32) IC3.13(B6)
ZX_A0: IC2.33(__IO_14) IC10.14(B5)
ZX_A1: IC2.34(__IO_15) IC10.13(B6)
ZX_A2: IC2.38(__IO_16) IC10.12(B7)
ZX_A3: IC2.39(__IO_17) IC10.11(B8)
ZX_A4: IC2.71(__IO_39) IC11.15(B4)
ZX_A5: IC2.70(__IO_38) IC11.16(B3)
ZX_A6: IC2.69(__IO_37) IC11.17(B2)
ZX_A7: IC2.68(__IO_36) IC11.18(B1)
ZX_A8: IC2.72(__IO_40) IC11.14(B5)
ZX_A9: IC2.73(__IO_41) IC11.13(B6)
ZX_A10: IC2.74(__IO_42) IC11.12(B7)
ZX_A11: IC2.75(__IO_43) IC11.11(B8)
ZX_A12: IC2.32(__IO_13) IC10.15(B4)
ZX_A13: IC2.31(__IO_12) IC10.16(B3)
ZX_A14: IC2.30(__IO_11) IC10.17(B2)
ZX_A15: IC2.28(__IO_10) IC10.18(B1)
Unconnected: CONN1.A15(VIDEO) CONN1.A16(YL) CONN1.A17(V) CONN1.A18(U) CONN1.A19(BUSREQ) CONN1.A26(BUSACK) CONN1.B15(HALT) CONN1.B21(WAIT) CONN1.B28(NC) IC2.25(__CLK3) IC2.88(__CLK7) IC2.89(__CLK6) IC2.90(__CLK5) IC2.91(__CLK4) IC14.4(XTAL2) J1.6 J1.7 J1.8 JP1.5 JP1.6 U1.4(SENSOR_VP) U1.5(SENSOR_VN) U1.17(SD2) U1.18(SD3) U1.19(CMD) U1.20(CLK) U1.21(SDO) U1.22(SD1) U1.32(NC) U$6.1(PA4) U$6.4(PA5) U$6.6(PA3) U$9.10(TSH) U$9.11(RSH) U$10.A5(E12) U$11.1(PA4) U$11.4(PA5) U$11.6(PA3) USB1.BODY@1(BODY) USB1.BODY@2(BODY) USB1.BODY@3(BODY) USB1.BODY@4(BODY) USB1.P1(VUSB) USB1.P4(USBID) X1.4 X1.9 X1.11 X1.12 X1.15

## Notes on the sheet
- Buttons | LEDs | USB-Serial
- FPGA
- QSPI SDRAM
- SD Card | Power Supplies | Expansion
- JTAG
- T10P
- T10N
- T11P
- T11N
- T12P
- T12N
- T16P | T16N
- ESP32
- VSPID
- VSPIWP
- VSPIHD
- VSPIQ
- VSPICLK
- VSPICS0
- Alt: BRCS4953DMF
- ZX Spectrum Interface | Voltage level converters
- +3 NOE for second ROM
- USB/Misc

## Power pins joined to a net without a drawn wire
+12V: CONN1.B22(+12V)
-5V: CONN1.B20(-5V)
-12V: CONN1.B23(-12V)

## Library data of the parts
C1-C56 C58 C61-C64 C66 C93-C101 = GadgetFactory:C: CAPACITOR, European symbol
C57 C60 C65 = alvie:TANT_CASE_A
C59 = cap-pan40:C-PR: POLARIZED ELECTROLYTIC/TANTALUM
CONN1 = zxspectrum:ZX_EDGE_DAUGHTERBOARD
IC1 = alvie:STMPS2141STR
IC2 = SamacSys_Parts:EP4CE6E22C8N: FPGA Cyclone IV 6272 Cells TQFP144 EP4CE6E22C8N, FPGA Cyclone IV E 6272 Cells, 270kbit, 392 Blocks, 1.15 1.25 V 144-Pin EQFP Source: Datasheet <https://componentsearchengine.com/Datasheets/1/EP4CE6E22C8N.pdf>; DESCRIPTION: FPGA Cyclone IV 6272 Cells TQFP144 EP4CE6E22C8N, FPGA Cyclone IV E 6272 Cells, 270kbit, 392 Blocks, 1.15 1.25 V 144-Pin EQFP; HEIGHT: 1.65mm; MANUFACTURER_NAME: Intel; MANUFACTURER_PART_NUMBER: EP4CE6E22C8N; MOUSER_PART_NUMBER: 989-EP4CE6E22C8N; MOUSER_PRICE-STOCK: https://www.mouser.com/Search/Refine.aspx?Keyword=989-EP4CE6E22C8N
IC3 IC4 IC10 IC11 = GadgetFactory:74*245: Octal BUS TRANSCEIVER, 3-state
IC5 IC6 = alvie:MP2233
IC7 = alvie:CH330N
IC8 = alvie:MIC550X
IC9 = alvie:LY68L6400
IC12 = alvie:USB1T*
IC13 = GadgetFactory:NC7WZ07P6X: Dual line drivers with 3-state outputs.
IC14 = sigedi-footprints:LAN8720A
J1 = 20021121-00010C4LF:AMPHENOL_ICC_-_FCI_20021121-00010C4LF: Connector Header Surface Mount 10 position 0.050" (1.27mm); AUTOMOTIVE: No; CENTROID_NOT_SPECIFIED: No; CONN_GENDER: Male; CONN_ORIENTATION: Vertical; CONTACT_MATERIAL: Gold,Nickel; CURRENT_RATING: 1A; DATASHEET: https://cdn.amphenol-icc.com/media/wysiwyg/files/documentation/datasheet/boardwiretoboard/bwb_minitek127_btb.pdf; DEVICE_CLASS_L1: Connectors; DEVICE_CLASS_L2: Headers and Wire Housings; DEVICE_CLASS_L3: unset; DIGIKEY_DESCRIPTION: CONN HEADER SMD 10POS 1.27MM; DIGIKEY_PART_NUMBER: 609-3695-1-ND; FOOTPRINT_URL: https://cdn.amphenol-icc.com/media/wysiwyg/files/drawing/20021121.pdf; FOOTPRINT_VARIANT_NAME_0: Recommended_Land_Pattern; HEIGHT: 4.8mm; LEAD_FREE: Yes; MF: Amphenol ICC / FCI; MFG_PACKAGE_IDENT: 0; MFG_PACKAGE_IDENT_DATE: 0; MFG_PACKAGE_IDENT_REV: 0; MOUSER_DESCRIPTION: Conn; Rect; BrdtoBrd; UnshroudedHeader; 10Cnts; SMT; 1.27x1.27mmSpng; MOUSER_PART_NUMBER: 649-202112100010C4LF; MPN: 20021121-00010C4LF; NUMBER_OF_CONTACTS: 10; NUMBER_OF_ROWS: 2; PACKAGE: HDR10; PITCH: 1.27mm; PREFIX: J; ROHS: Yes; TEMPERATURE_RANGE_HIGH: +125°C; TEMPERATURE_RANGE_LOW: -55°C; VERIFICATION_VERSION: 0.0.0.3; VOLTAGE_RATING: 125V
JP1 = SparkFun-Connectors:PINHD-2X10: PIN HEADER
L1 L2 = alvie:VLS201610HBX
L8 = GadgetFactory:L: INDUCTOR, European symbol
LED1-LED6 = dp_devices:LED: Light Emitting Diode
Q1 Q2 Q6 = transistor-small-signal:BSS123: N-CHANNEL MOS FET
Q3 Q4 = alvie:CJ3439KDW
Q5 = transistor-small-signal:BSS84: P-CHANNEL MOS FET
R1-R71 R78-R88 = GadgetFactory:R: RESISTOR, European symbol
RN1-RN8 = resistor-dil:4R-N: Array Chip Resistor Source: RS Component / Phycomp; OC_FARNELL: unknown; OC_NEWARK: unknown
S1-S3 = EAGLE_BoosterPack_Library:SWITCHES_: Various NO switches- pushbuttons, reed, etc
SD1 = alvie:1040310811
T1 = alvie:HR913550A
TP1-TP4 = testpad:TP: Test pad
TV26 = alvie:SP0503BAHT
U1 = esp32:ESP-WROOM-32
U$1 = alvie:KC3225K
U$2 U$5 U$8 U$10 = alvie:INTERFACEZ_EDGE
U$3 U$6 U$11 = alvie:PMS150C-U06
U$4 = alvie:BSS84DW
U$7 = alvie:PIN-1X10
U$9 = alvie:PJ328-A0
U$15 = alvie:PIN-2X5-1.27MM
U$16 = alvie:PIN-2X5
USB1 = dp_devices:CON-USB-F: USB Female connector
USB2 = con-usb:USB: USB Connectors
X1 = con-subd:F15: SUB-D; OC_FARNELL: unknown; OC_NEWARK: unknown